# EasyEDA Pro project TSAL大改.eprj

# Schematic Schematic1
Create Date: 2023-09-30; Page Name: P1; Project Name: TSAL大改; Schematic Name: Schematic1; Update Date: 2023-11-05; Company: 嘉立创EDA; Page Size: A4; Version: V1.0
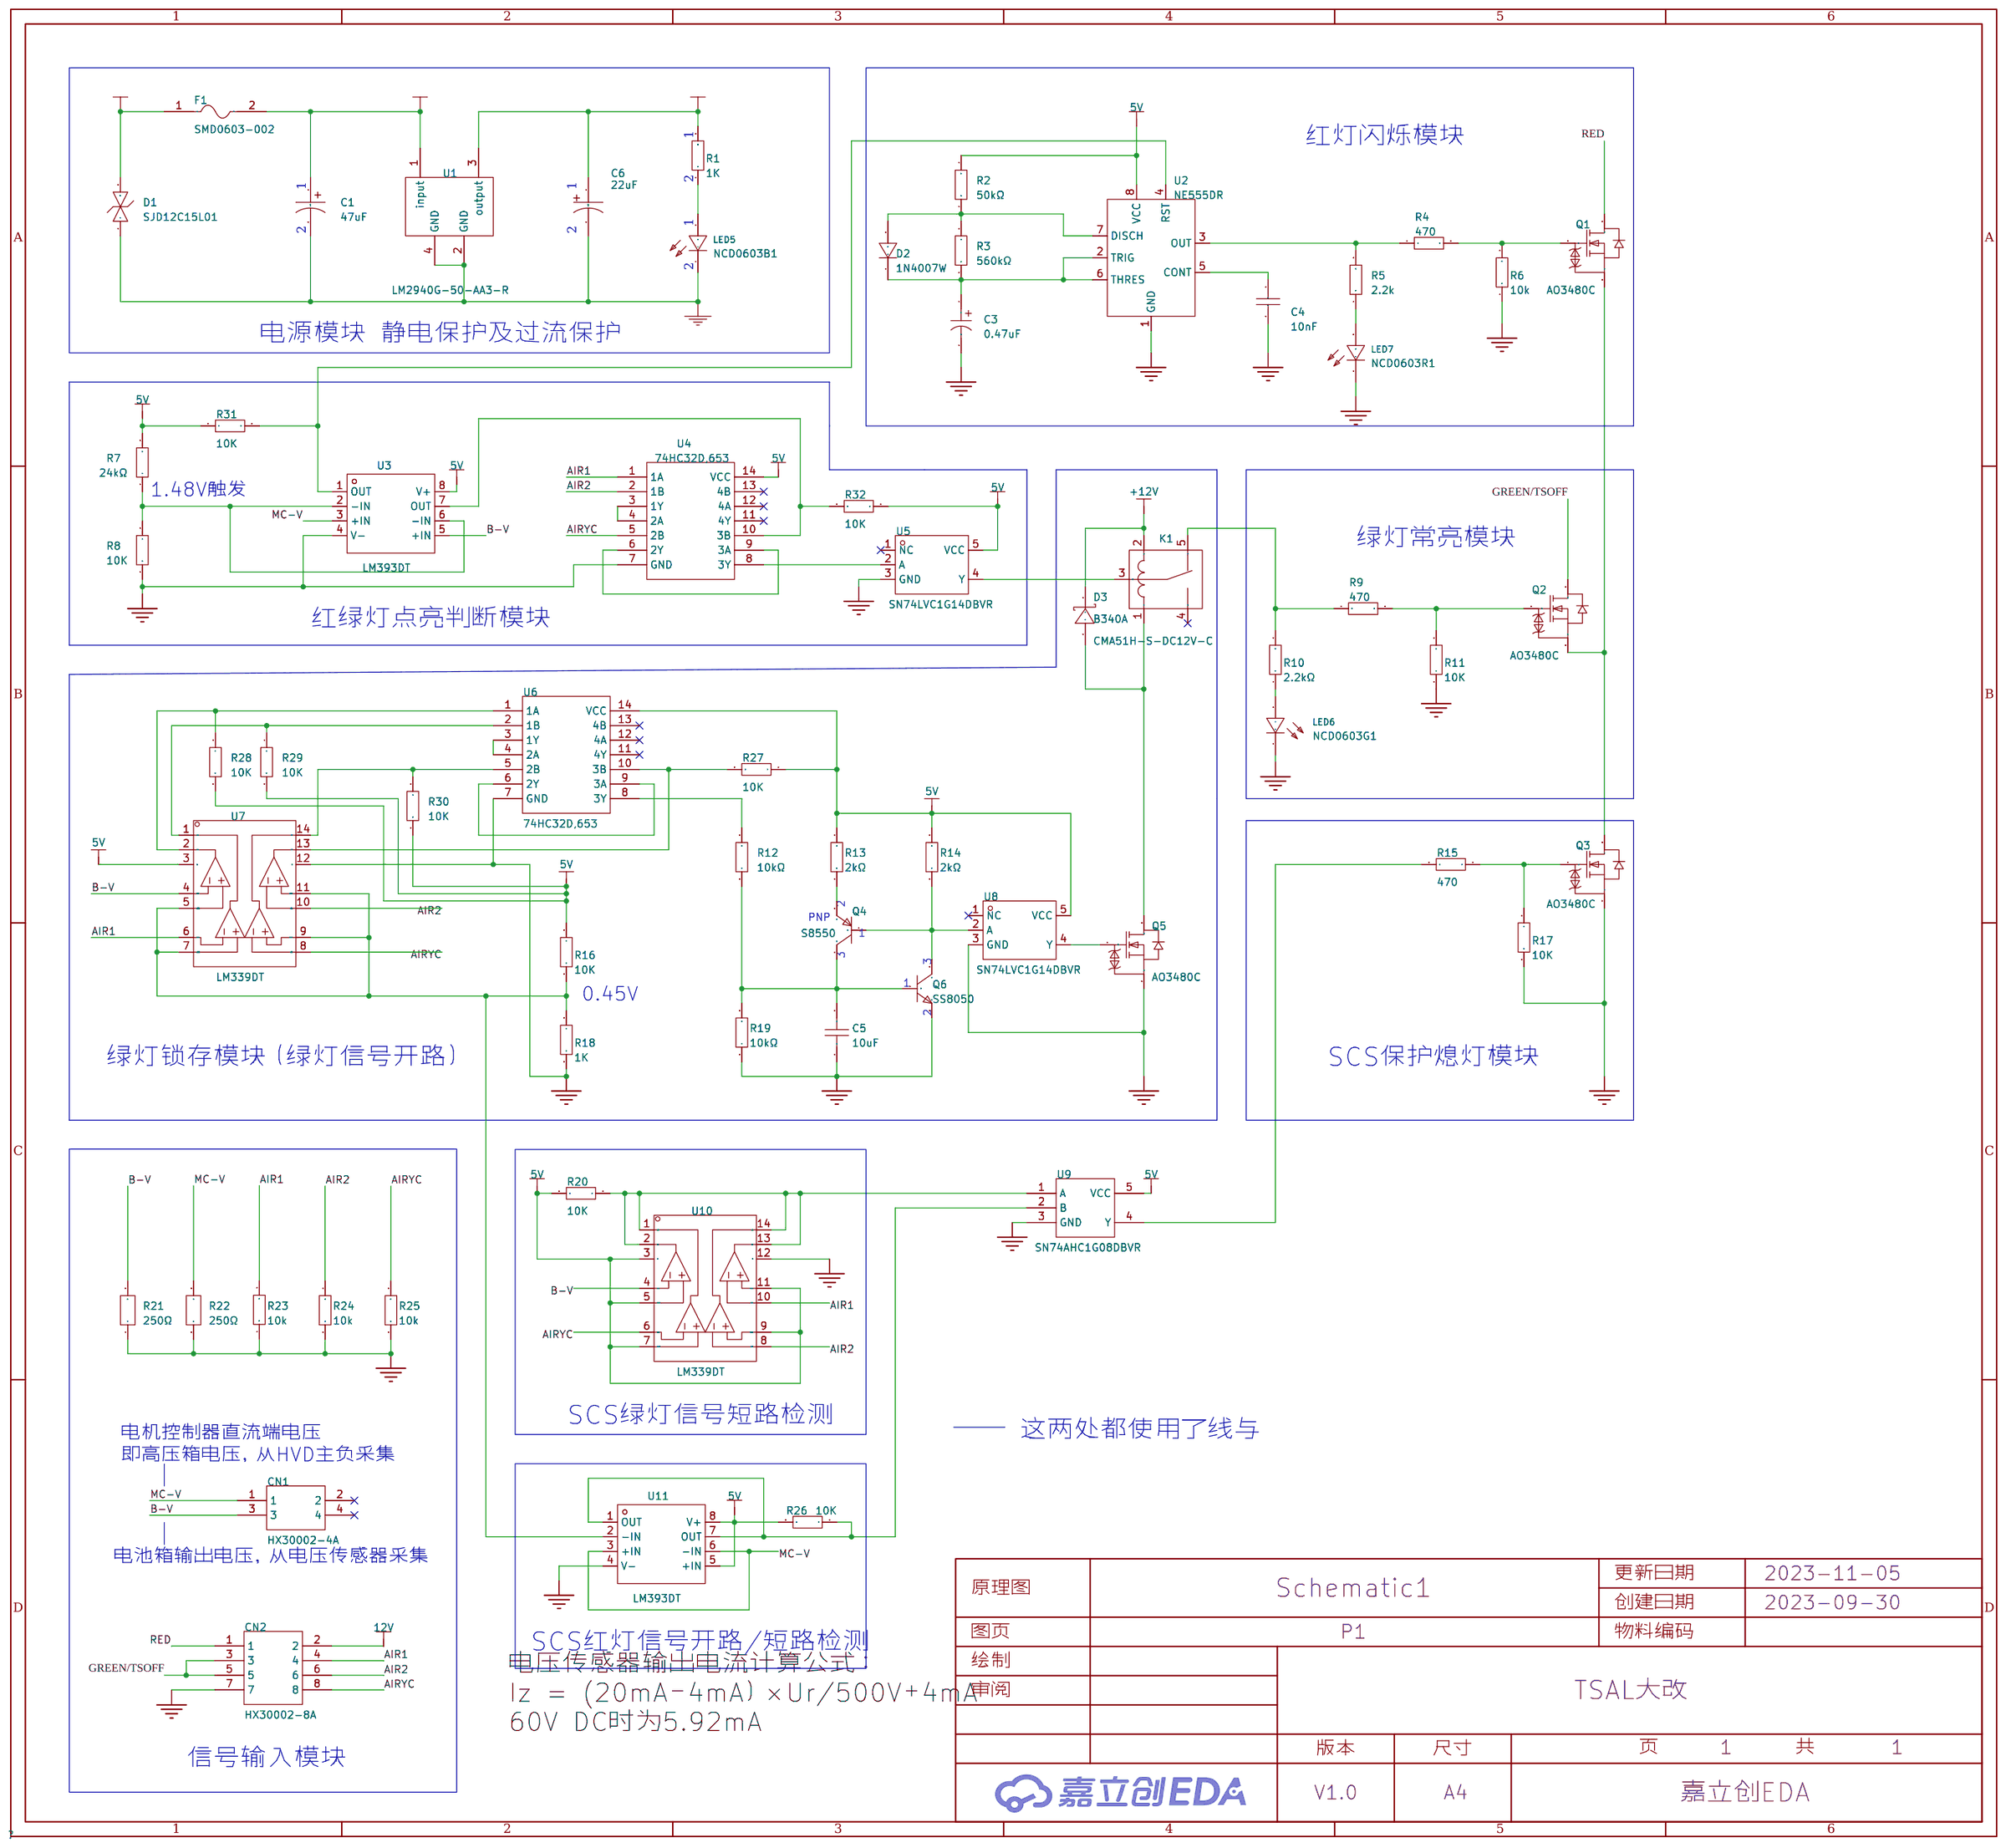
[diagram p0: schematic sheet]

## Parts
C1  47uF  [CAP-SMD_BD8.0-L8.3-W8.3-FD]
C3  0.47uF  [CAP-SMD_L3.2-W1.6-FD-1]
C4  10nF  [C0603]
C5  10uF  [C0603]
C6  22uF  [CAP-SMD_BD6.3-L6.6-W6.6-FD]
CN1  HX30002-4A  [CONN-TH_30002-4A-T1P]
CN2  HX30002-8A  [CONN-TH_30002-8A-T1P]
D1  SJD12C15L01  [SOD-123_L2.7-W1.6-LS3.7-BI]
D2  1N4007W  [SOD-123_L2.8-W1.8-LS3.7-RD]
D3  B340A  [SMA_L4.3-W2.6-LS5.1-RD]
F1  SMD0603-002  [F0603]
K1  CMA51H-S-DC12V-C  [RELAY-TH_CMA51H-S-DCXX-C]
LED5  NCD0603B1  [LED0603-RD]
LED6  NCD0603G1  [LED0603-RD]
LED7  NCD0603R1  [LED0603-RD_RED]
Q1  AO3480C  [SOT-23-3_L2.9-W1.6-P1.90-LS2.8-BR]
Q2  AO3480C  [SOT-23-3_L2.9-W1.6-P1.90-LS2.8-BR]
Q3  AO3480C  [SOT-23-3_L2.9-W1.6-P1.90-LS2.8-BR]
Q4  S8550  [SOT-23-3_L2.9-W1.6-P1.90-LS2.8-BR]
Q5  AO3480C  [SOT-23-3_L2.9-W1.6-P1.90-LS2.8-BR]
Q6  SS8050  [SOT-23-3_L2.9-W1.3-P1.90-LS2.4-BR]
R1  1K  [R0603]
R2  50kΩ  [R0603]
R3  560kΩ  [R0603]
R4  470  [R0603]
R5  2.2k  [R0603]
R6  10k  [R0603]
R7  24kΩ  [R0603]
R8  10K  [R0603]
R9  470  [R0603]
R10  2.2kΩ  [R0603]
R11  10K  [R0603]
R12  10kΩ  [R0603]
R13  2kΩ  [R0603]
R14  2kΩ  [R0603]
R15  470  [R0603]
R16  10K  [R0603]
R17  10K  [R0603]
R18  1K  [R0603]
R19  10kΩ  [R0603]
R20  10K  [R0603]
R21  250Ω  [R0603]
R22  250Ω  [R0603]
R23  10k  [R0603]
R24  10k  [R0603]
R25  10k  [R0603]
R26  10K  [R0603]
R27  10K  [R0603]
R28  10K  [R0603]
R29  10K  [R0603]
R30  10K  [R0603]
R31  10K  [R0603]
R32  10K  [R0603]
U1  LM2940G-50-AA3-R  [SOT-223-4_L6.5-W3.5-P2.30-LS7.0-BR]
U2  NE555DR  [SOIC-8_L4.9-W3.9-P1.27-LS6.0-BL]
U3  LM393DT  [SOIC-8_L5.0-W4.0-P1.27-LS6.0-BL]
U4  74HC32D,653  [SOIC-14_L8.7-W3.9-P1.27-LS6.0-BL]
U5  SN74LVC1G14DBVR  [SOT-23-5_L3.0-W1.7-P0.95-LS2.8-BR]
U6  74HC32D,653  [SOIC-14_L8.7-W3.9-P1.27-LS6.0-BL]
U7  LM339DT  [SOIC-14_L8.7-W3.9-P1.27-LS6.0-BL]
U8  SN74LVC1G14DBVR  [SOT-23-5_L3.0-W1.7-P0.95-LS2.8-BR]
U9  SN74AHC1G08DBVR  [SOT-23-5_L3.0-W1.7-P0.95-LS2.8-BR]
U10  LM339DT  [SOIC-14_L8.7-W3.9-P1.27-LS6.0-BL]
U11  LM393DT  [SOIC-8_L5.0-W4.0-P1.27-LS6.0-BL]

## Library data of the parts
C1 = HBW470M1JTR-0810: 容值:47uF;精度:±20%;额定电压:63V;; LCSC Part Name: 47uF ±20% 63V; Supplier Part: C3031616; Manufacturer: lelon(立隆); Supplier Footprint: SMD,D8xL10mm; JLCPCB Part Class: Extended Part; Datasheet: https://atta.szlcsc.com/upload/public/pdf/source/20220826/AE5C81AD789A3503116A80B6D4FBEF01.pdf; Supplier: LCSC; Tolerance: ±20%; Rated Voltage: 63V; Check: false
C3 = CA45A-A-35V-0.47UF-K: 容值:470nF;精度:±10%;额定电压:35V;; LCSC Part Name: 470nF ±10% 35V; Supplier Part: C2976923; Manufacturer: CEC(振华新云); Supplier Footprint: SMD,1.6x3.2mm; JLCPCB Part Class: 扩展库; Datasheet: https://atta.szlcsc.com/upload/public/pdf/source/20220222/C2C5F368BEBB90E653B4407F98E5644A.pdf; Supplier: LCSC; Tolerance: ±10%; Rated Voltage: 35V; Operating Temperature: -55℃~+125℃; Check: false
C4 = 0603B103K500NT: 容值:10nF;精度:±10%;额定电压:50V;材质(温度系数):X7R;; LCSC Part Name: 10nF ±10% 50V; Supplier Part: C57112; Manufacturer: FH(风华); Supplier Footprint: 0603; JLCPCB Part Class: Basic Part; Datasheet: https://atta.szlcsc.com/upload/public/pdf/source/20170923/C57112_1506149495135988846.pdf; Supplier: LCSC; Tolerance: ±10%; Voltage Rated: 50V; Temperature Coefficient: X7R; Check: false
C5 = CL10A106KP8NNNC: 容值:10uF;精度:±10%;额定电压:10V;材质(温度系数):X5R;; LCSC Part Name: 10uF ±10% 10V; Supplier Part: C19702; Manufacturer: SAMSUNG(三星); Supplier Footprint: 0603; JLCPCB Part Class: Basic Part; Datasheet: https://atta.szlcsc.com/upload/public/pdf/source/20160103/1457707703378.pdf; Supplier: LCSC; Tolerance: ±10%; Voltage Rated: 10V; Temperature Coefficient: X5R; Check: false
C6 = EEHZA1J220XP: 容值:22uF;额定电压:63V;等效串联电阻:80mΩ 100kHz;纹波电流:1.5A 100kHz;工作温度:-55℃~+105℃;类型:-;电容体长度:7.7mm;精度:±20%;电容体直径:6.3mm;脚间距:-;工作寿命:10000hrs 105℃;; LCSC Part Name: 22uF 63V; Supplier Part: C454662; Manufacturer: PANASONIC(松下); Supplier Footprint: SMD,6.3x7.7mm; JLCPCB Part Class: Extended Part; Supplier: LCSC; Rated Voltage: 63V; Equivalent Series Resistance(ESR): 80mΩ 100kHz; Ripple Current: 1.5A 100kHz; Operating Temperature: -55℃~+105℃; L: 7.7mm; Tolerance: ±20%; φD: 6.3mm; Lifetime @ Temp: 10000hrs 105℃
CN1 = HX30002-4A: 参考系列:-;间距:3mm;插针结构:2x2P;排数:2;每排PIN数:2;行距:3mm;安装方式:-;触头材质:黄铜;; LCSC Part Name: 3mm 2x2P; Supplier Part: C185089; Manufacturer: HX(红星); Supplier Footprint: 插件,P=3mm; JLCPCB Part Class: Extended Part; Datasheet: https://atta.szlcsc.com/upload/public/pdf/source/20180316/20CB846A033341ED63BC42C0B6CD4AD3.pdf; Supplier: LCSC; Pitch: 3mm; Pins Structure: 2x2P; Number of Rows: 2; Number of PINs Per Row: 2; Row Spacing: 3mm; Contact Material: 黄铜; Check: false
CN2 = HX30002-8A: 参考系列:-;间距:3mm;插针结构:2x4P;排数:2;每排PIN数:4;行距:3mm;安装方式:-;触头材质:黄铜;; LCSC Part Name: 3mm 2x4P; Supplier Part: C185091; Manufacturer: HX(红星); Supplier Footprint: 插件,P=3mm; JLCPCB Part Class: Extended Part; Datasheet: https://atta.szlcsc.com/upload/public/pdf/source/20180316/D977F4BC65FE6A384A4F595F180FB6F1.pdf; Supplier: LCSC; Pitch: 3mm; Pins Structure: 2x4P; Number of Rows: 2; Number of PINs Per Row: 4; Row Spacing: 3mm; Contact Material: 黄铜; Check: false
D1 = SJD12C15L01: 反向截止电压(Vrwm):15V;击穿电压(VBR):16.7V;峰值脉冲电流(Ipp)@8/20us:8.2A;钳位电压(Vc)@Ipp:24.4V;; Supplier Part: C78437; Manufacturer: Brightking(君耀电子); Supplier Footprint: SOD-123; JLCPCB Part Class: Extended Part; Datasheet: https://atta.szlcsc.com/upload/public/pdf/source/20160709/1468031891025.pdf; Supplier: LCSC; Reverse Stand-Off Voltage (Vrwm): 15V; Breakdown Voltage (VBR): 16.7V; Peak Pulse Current(Ipp)@8/20us: 8.2A; Clamping Voltage@Ipp: 24.4V; Check: false
D2 = 1N4007W_C328592: 二极管配置:独立式;直流反向耐压(Vr):1kV;平均整流电流(Io):1A;正向压降(Vf):1.1V@1A;反向电流(Ir):5uA@1kV;; LCSC Part Name: 1kV 1A 1.1V@1A; Supplier Part: C328592; Manufacturer: BLUE ROCKET(蓝箭); Supplier Footprint: SOD-123FL; JLCPCB Part Class: Extended Part; Datasheet: https://atta.szlcsc.com/upload/public/pdf/source/20181114/C328592_04E3210D024E6B45F90C676B98EEA6C7.pdf; Supplier: LCSC; Diode Configuration: 独立式; Reverse Voltage (Vr): 1kV; Average Rectified Current (Io): 1A; Forward Voltage (Vf@If): 1.1V@1A; Reverse Leakage Current: 5uA@1kV; Check: false
D3 = B340A: 直流反向耐压(Vr):40V;平均整流电流(Io):3A;正向压降(Vf):550mV@3A;; LCSC Part Name: 40V 3A 550mV@3A; Supplier Part: C64982; Manufacturer: MDD; Supplier Footprint: SMA(DO-214AC); JLCPCB Part Class: Extended Part; Datasheet: https://atta.szlcsc.com/upload/public/pdf/source/20230314/FEC98C79C2B2FE8CB6E84FEE53FCCA40.pdf; Supplier: LCSC; Reverse Voltage (Vr): 40V; Average Rectified Current (Io): 3A; Forward Voltage (Vf@If): 550mV@3A; Check: false
F1 = SMD0603-002: 30V,0.02A; LCSC Part Name: 20mA,30V; Supplier Part: C3646886; Manufacturer: 台湾陆海; Supplier Footprint: 0603; JLCPCB Part Class: Extended Part; Datasheet: https://atta.szlcsc.com/upload/public/pdf/source/20230404/20B4F423E9D21310C61C06C0FA62271A.pdf; Supplier: LCSC; Check: false
K1 = CMA51H-S-DC12V-C: 引脚数:5;线圈电压:12V;触点形式:一组转换:1C(单刀双掷-转换);触点容量(电阻负载):15A@14VDC;触点材料:银合金;; LCSC Part Name: 12V继电器 单刀双掷; Supplier Part: C125689; Manufacturer: HKE(汇港); Supplier Footprint: 插件,12.2x15.6mm; JLCPCB Part Class: Extended Part; Datasheet: https://atta.szlcsc.com/upload/public/pdf/source/20171228/C125689_15144410502411213448.pdf; Supplier: LCSC; Pin Number: 5; Coil Voltage: 12V; Coil Rated Power: 600mW; Contact Form: 一组转换:1C(单刀双掷-转换); Contact Rating: 15A@14VDC; Coil Resistance: 240Ω; Maximum Switching Current: 30V@DC; Maximum Switching Voltage: 35A; Operate Time: 10ms; Release Time: 10ms; Coil Type: 非极化-单线圈; Contact Resistance: 50mΩ; Contact Material: 银合金; Operating Temperature: -40℃~+85℃; Check: false
LED5 = NCD0603B1: 发光颜色:蓝灯;; LCSC Part Name: 蓝灯; Supplier Part: C84266; Manufacturer: 国星光电; Supplier Footprint: 0603; JLCPCB Part Class: 扩展库; Datasheet: https://atta.szlcsc.com/upload/public/pdf/source/20200820/C84266_6A3CDBEFA72C6CAD68EDA53474ADAE6C.pdf; Supplier: LCSC; Emitted Color: 蓝灯
LED6 = NCD0603G1: 发光颜色:翠绿;; LCSC Part Name: 翠绿 0603翠绿  正贴; Supplier Part: C84267; Manufacturer: 国星光电; Supplier Footprint: 0603; JLCPCB Part Class: 扩展库; Datasheet: https://atta.szlcsc.com/upload/public/pdf/source/20200820/C84267_04BA7703640BAC111D09F5EFB971FBF3.pdf; Supplier: LCSC; Emitted Color: 翠绿
LED7 = NCD0603R1_C84263: 发光颜色:红灯;; LCSC Part Name: 红灯 0603红灯   正贴; Supplier Part: C84263; Manufacturer: 国星光电; Supplier Footprint: 0603; JLCPCB Part Class: 扩展库; Datasheet: https://atta.szlcsc.com/upload/public/pdf/source/20200820/C84263_DABC6A75E58F576973B407FDBA283D60.pdf; Supplier: LCSC; Emitted Color: 红灯
Q1-Q3 Q5 = AO3480C: 类型:N沟道;漏源电压(Vdss):30V;连续漏极电流(Id):6.2A;功率(Pd):1.3W;导通电阻(RDS(on)@Vgs,Id):16mΩ@10V,6.2A;阈值电压(Vgs(th)@Id):1.8V@250uA;栅极电荷(Qg@Vgs):6nC@10V;输入电容(Ciss@Vds):600pF@15V;反向传输电容(Crss@Vds):60pF@15V;工作温度:-55℃~+150℃@(Tj);; LCSC Part Name: N沟道 30V 6.2A; Supplier Part: C705501; Manufacturer: AOS; Supplier Footprint: SOT-23-3L; JLCPCB Part Class: Extended Part; Datasheet: https://atta.szlcsc.com/upload/public/pdf/source/20200730/C705501_5961B3651997EC68199D4D166737E94A.pdf; Supplier: LCSC; Type: N沟道; Drain Source Voltage (Vdss): 30V; Continuous Drain Current (Id): 6.2A; Power Dissipation (Pd): 1.3W; Drain Source On Resistance (RDS(on)@Vgs,Id): 16mΩ@10V,6.2A; Gate Threshold Voltage (Vgs(th)@Id): 1.8V@250uA; Total Gate Charge (Qg@Vgs): 6nC@10V; Input Capacitance (Ciss@Vds): 600pF@15V; Reverse Transfer Capacitance (Crss@Vds): 60pF@15V; Operating Temperature: -55℃~+150℃@(Tj); Check: false
Q4 = S8550_C105432: 晶体管类型:PNP;集射极击穿电压(Vceo):25V;集电极电流(Ic):500mA;功率(Pd):300mW;直流电流增益(hFE@Ic,Vce):120@50mA,1V;; LCSC Part Name: PNP 25V 500mA L档120-200; Supplier Part: C105432; Manufacturer: CJ(江苏长电/长晶); Supplier Footprint: SOT-23; JLCPCB Part Class: Basic Part; Datasheet: https://atta.szlcsc.com/upload/public/pdf/source/20170413/1492062713649.pdf; Supplier: LCSC; Transistor Type: PNP; Collector-Emitter Breakdown Voltage (Vceo): 25V; Collector Current (Ic): 500mA; Power Dissipation (Pd): 300mW; Collector Cut-Off Current (Icbo): 100nA; Collector-Emitter Saturation Voltage (VCE(sat)@Ic,Ib): 600mV@500mA,50mA; DC Current Gain (hFE@Ic,Vce): 120@50mA,1V; Transition Frequency (fT): 150MHz; Operating Temperature: +150℃@(Tj); Check: false
Q6 = SS8050_C2150: 晶体管类型:NPN;集射极击穿电压(Vceo):25V;集电极电流(Ic):1.5A;功率(Pd):300mW;直流电流增益(hFE@Ic,Vce):200@100mA,1V;; LCSC Part Name: NPN 25V 1.5A Y1 200-350; Supplier Part: C2150; Manufacturer: CJ(江苏长电/长晶); Supplier Footprint: SOT-23; JLCPCB Part Class: Basic Part; Datasheet: https://atta.szlcsc.com/upload/public/pdf/source/20230322/AEE86F4B043774EFF80CAEA14A37D9E9.pdf; Supplier: LCSC; Transistor Type: NPN; Collector-Emitter Breakdown Voltage (Vceo): 25V; Collector Current (Ic): 1.5A; Power Dissipation (Pd): 300mW; Collector Cut-Off Current (Icbo): 100nA; Collector-Emitter Saturation Voltage (VCE(sat)@Ic,Ib): 500mV@800mA,80mA; DC Current Gain (hFE@Ic,Vce): 200@100mA,1V; Transition Frequency (fT): 100MHz; Operating Temperature: +150℃@(Tj); Check: false
R1 R18 = 0603WAF6800T5E: 电阻类型:厚膜电阻;阻值:680Ω;精度:±1%;功率:100mW;; LCSC Part Name: 680Ω ±1% 100mW; Supplier Part: C23228; Manufacturer: UNI-ROYAL(厚声); Supplier Footprint: 0603; JLCPCB Part Class: Basic Part; Datasheet: https://atta.szlcsc.com/upload/public/pdf/source/20200306/C422600_1E6D84923E4A46A82E41ADD87F860B5C.pdf; Supplier: LCSC; Type: 厚膜电阻; Tolerance: ±1%; Power(Watts): 100mW; Temperature Coefficient: ±100ppm/℃; Overload Voltage (Max): 75V; Operating Temperature Range: -55℃~+155℃; Check: false
R2 = AR03BTC5002A: 阻值:50kΩ;精度:±0.1%;功率:62.5mW;; LCSC Part Name: 50kΩ ±0.1% 62.5mW; Supplier Part: C304067; Manufacturer: Viking(光颉); Supplier Footprint: 0603; JLCPCB Part Class: Extended Part; Datasheet: https://atta.szlcsc.com/upload/public/pdf/source/20180929/C304067_C6C1AA1A73175DF88A934A2863C540D5.pdf; Supplier: LCSC; Tolerance: ±0.1%; Power(Watts): 62.5mW; Temperature Coefficient: ±25ppm/℃
R3 = 0603WAF5603T5E: 电阻类型:厚膜电阻;阻值:560kΩ;精度:±1%;功率:100mW;; LCSC Part Name: 560kΩ ±1% 100mW; Supplier Part: C23203; Manufacturer: UNI-ROYAL(厚声); Supplier Footprint: 0603; JLCPCB Part Class: 基础库; Datasheet: https://atta.szlcsc.com/upload/public/pdf/source/20200306/C422600_1E6D84923E4A46A82E41ADD87F860B5C.pdf; Supplier: LCSC; Type: 厚膜电阻; Tolerance: ±1%; Power(Watts): 100mW; Temperature Coefficient: ±100ppm/℃; Overload Voltage (Max): 75V; Operating Temperature Range: -55℃~+155℃
R4 R9 R15 = 0603WAF4700T5E: 电阻类型:厚膜电阻;阻值:470Ω;精度:±1%;功率:100mW;; LCSC Part Name: 470Ω ±1% 100mW; Supplier Part: C23179; Manufacturer: UNI-ROYAL(厚声); Supplier Footprint: 0603; JLCPCB Part Class: Basic Part; Datasheet: https://atta.szlcsc.com/upload/public/pdf/source/20200306/C422600_1E6D84923E4A46A82E41ADD87F860B5C.pdf; Supplier: LCSC; Type: 厚膜电阻; Tolerance: ±1%; Power(Watts): 100mW; Temperature Coefficient: ±100ppm/℃; Overload Voltage (Max): 75V; Operating Temperature Range: -55℃~+155℃; Check: false
R5 R10 = 0603WAF2201T5E: 电阻类型:厚膜电阻;阻值:2.2kΩ;精度:±1%;功率:100mW;; LCSC Part Name: 2.2kΩ ±1% 100mW; Supplier Part: C4190; Manufacturer: UNI-ROYAL(厚声); Supplier Footprint: 0603; JLCPCB Part Class: Basic Part; Datasheet: https://atta.szlcsc.com/upload/public/pdf/source/20200306/C422600_1E6D84923E4A46A82E41ADD87F860B5C.pdf; Supplier: LCSC; Type: 厚膜电阻; Tolerance: ±1%; Power(Watts): 100mW; Temperature Coefficient: ±100ppm/℃; Overload Voltage (Max): 75V; Operating Temperature Range: -55℃~+155℃; Check: false
R6 R12 R19 R23-R25 = 0603WAF1002T5E: 电阻类型:厚膜电阻;阻值:10kΩ;精度:±1%;功率:100mW;; LCSC Part Name: 厚膜电阻 10kΩ ±1% 100mW; Supplier Part: C25804; Manufacturer: UNI-ROYAL(厚声); Supplier Footprint: 0603; JLCPCB Part Class: Basic Part; Datasheet: https://atta.szlcsc.com/upload/public/pdf/source/20200306/C422600_1E6D84923E4A46A82E41ADD87F860B5C.pdf; Supplier: LCSC; Type: 厚膜电阻; Tolerance: ±1%; Power(Watts): 100mW; Temperature Coefficient: ±100ppm/℃; Overload Voltage (Max): 75V; Operating Temperature Range: -55℃~+155℃; Check: false
R7 = 0603WAF2402T5E: 电阻类型:厚膜电阻;阻值:24kΩ;精度:±1%;功率:100mW;; LCSC Part Name: 24kΩ ±1% 100mW; Supplier Part: C23352; Manufacturer: UNI-ROYAL(厚声); Supplier Footprint: 0603; JLCPCB Part Class: 基础库; Datasheet: https://atta.szlcsc.com/upload/public/pdf/source/20200306/C422600_1E6D84923E4A46A82E41ADD87F860B5C.pdf; Supplier: LCSC; Type: 厚膜电阻; Tolerance: ±1%; Power(Watts): 100mW; Temperature Coefficient: ±100ppm/℃; Overload Voltage (Max): 75V; Operating Temperature Range: -55℃~+155℃
R8 R11 R16 R17 R20 R26-R32 = Res_0603: Supplier Footprint: 0603; Check: false
R13 R14 = 0603WAF2001T5E: 电阻类型:厚膜电阻;阻值:2kΩ;精度:±1%;功率:100mW;; LCSC Part Name: 2kΩ ±1% 100mW; Supplier Part: C22975; Manufacturer: UNI-ROYAL(厚声); Supplier Footprint: 0603; JLCPCB Part Class: Basic Part; Datasheet: https://atta.szlcsc.com/upload/public/pdf/source/20200306/C422600_1E6D84923E4A46A82E41ADD87F860B5C.pdf; Supplier: LCSC; Type: 厚膜电阻; Tolerance: ±1%; Power(Watts): 100mW; Temperature Coefficient: ±100ppm/℃; Overload Voltage (Max): 75V; Operating Temperature Range: -55℃~+155℃; Check: false
R21 R22 = ARG03DTC2500: 电阻类型:薄膜电阻;阻值:250Ω;精度:±0.5%;功率:100mW;; LCSC Part Name: 250Ω ±0.5% 100mW; Supplier Part: C2828652; Manufacturer: Viking(光颉); Supplier Footprint: 0603; JLCPCB Part Class: Extended Part; Datasheet: https://atta.szlcsc.com/upload/public/pdf/source/20211009/C2828652_FB7EDA2C6E724E0EB8482109143029B0.pdf; Supplier: LCSC; Type: 薄膜电阻; Tolerance: ±0.5%; Power(Watts): 100mW; Temperature Coefficient: ±25ppm/℃; Overload Voltage (Max): 75V; Operating Temperature Range: -55℃~+155℃
U1 = LM2940G-50-AA3-R: 输出类型:固定;输出极性:正;输出通道数:1;最大输入电压:26V;输出电压:5V;压差:800mV@(1A);输出电流:1A;电源纹波抑制比(PSRR):72dB@(120Hz);; LCSC Part Name: 正 Vin=26V Vout=5V 1A 72dB@(120Hz); Supplier Part: C71094; Manufacturer: UTC(友顺); Supplier Footprint: SOT-223-4; JLCPCB Part Class: Extended Part; Datasheet: https://atta.szlcsc.com/upload/public/pdf/source/20160416/1460799393051.pdf; Supplier: LCSC; Output Type: 固定; Output Polarity: 正; Number of Outputs: 1; Maximum Input Voltage: 26V; Output Voltage: 5V; Dropout Voltage: 800mV@(1A); Output Current: 1A; Power Supply Rejection Ratio (PSRR): 72dB@(120Hz); Check: false
U2 = NE555DR_C7593: 类型:555 型，计时器/振荡器(单路);计数:-;工作电压:4.5V~16V;工作电流:10mA;工作温度:0℃~+70℃;; Supplier Part: C7593; Manufacturer: TI(德州仪器); Supplier Footprint: SOIC-8-150mil; JLCPCB Part Class: Basic Part; Datasheet: https://atta.szlcsc.com/upload/public/pdf/source/20140704/1457707116116.pdf; Supplier: LCSC; Type: 555 型，计时器/振荡器(单路); Supply Voltage: 4.5V~16V; Supply Current: 10mA; Operating Temperature: 0℃~+70℃; Check: false
U3 U11 = LM393DT: 比较器组数:2;电源电压:2V~36V,±1V~18V;各通道供电电流:2.5mA;输出类型:CMOS, MOS, Open-Collector, TTL;传播延迟:-;; Supplier Part: C32901; Manufacturer: ST(意法半导体); Supplier Footprint: SOIC-8; JLCPCB Part Class: Extended Part; Datasheet: https://atta.szlcsc.com/upload/public/pdf/source/20140704/1457707098538.pdf; Supplier: LCSC; Number of Elements: 2; Supply Voltage（Single）: 2V~36V,±1V~18V; Iq per channel (Typ): 2.5mA; Output Type: CMOS, MOS, Open-Collector, TTL; Operating Temperature: 0°C ~ 70°C; Check: false
U4 U6 = 74HC32D,653: 逻辑电路的归属系列:74HC;逻辑类型:或门;通道数:4;每通道输入数:2;电源电压:2V~6V;静态电流(最大值):2uA;; LCSC Part Name: 或门; Supplier Part: C5632; Manufacturer: Nexperia(安世); Supplier Footprint: SOIC-14-150mil; JLCPCB Part Class: Extended Part; Datasheet: https://atta.szlcsc.com/upload/public/pdf/source/20120402/1457706456034.pdf; Supplier: LCSC; Series: 74HC; Logic Type: 或门; number of channels: 4; Number of inputs per channel: 2; Supply Voltage(Single): 2V~6V; Quiescent Current (Max): 2uA; Max Propagation Delay @ V, Max CL: 15ns@6V,50pF; Low Level Output Current: 5.2mA; Hight Level Output Current: 5.2mA; Logical Level - High: 1.5V~4.2V; Logical Level - low: 0.5V~1.8V; Operating Temperature: -40℃~+125℃; Check: false
U5 = SN74LVC1G14DBVR_C434069: 逻辑电路的归属系列:-;逻辑类型:-;电路/元件数:-;输入数/每元件位数:-;电源电压:-;静态电流（最大值）:-;; LCSC Part Name: 门极和反相器; Supplier Part: C434069; Manufacturer: UMW(广东友台半导体); Supplier Footprint: SOT-23-5; JLCPCB Part Class: Extended Part; Datasheet: https://atta.szlcsc.com/upload/public/pdf/source/20190930/C434069_601D37537AF749E7095B833416EB8C97.pdf; Supplier: LCSC
U7 U10 = LM339DT: 比较器组数:4;电源电压:2V ~ 32V, ±1V ~ 16V;各通道供电电流:2.5mA;输出类型:CMOS, DTL, ECL, MOS, Open-Collector, TTL;传播延迟:-;; Supplier Part: C71036; Manufacturer: ST(意法半导体); Supplier Footprint: SO14; JLCPCB Part Class: Extended Part; Datasheet: https://atta.szlcsc.com/upload/public/pdf/source/20160408/1460100649765.pdf; Supplier: LCSC; Number of Elements: 4; Supply Voltage（Single）: 2V ~ 32V, ±1V ~ 16V; Iq per channel (Typ): 2.5mA; Output Type: CMOS, DTL, ECL, MOS, Open-Collector, TTL; Operating Temperature: 0°C ~ 70°C; Check: false
U8 = SN74LVC1G14DBVR_C434069: 逻辑电路的归属系列:-;逻辑类型:-;电路/元件数:-;输入数/每元件位数:-;电源电压:-;静态电流（最大值）:-;; LCSC Part Name: 门极和反相器; Supplier Part: C434069; Manufacturer: UMW(广东友台半导体); Supplier Footprint: SOT-23-5; JLCPCB Part Class: Extended Part; Datasheet: https://atta.szlcsc.com/upload/public/pdf/source/20190930/C434069_601D37537AF749E7095B833416EB8C97.pdf; Supplier: LCSC; Check: false
U9 = SN74AHC1G08DBVR: 逻辑电路的归属系列:74AHC;逻辑类型:与门;通道数:1;每通道输入数:2;电源电压:2V~5.5V;静态电流(最大值):1uA;; LCSC Part Name: 与门; Supplier Part: C7467; Manufacturer: TI(德州仪器); Supplier Footprint: SOT-23-5; JLCPCB Part Class: 扩展库; Datasheet: https://atta.szlcsc.com/upload/public/pdf/source/20140711/1457707153876.pdf; Supplier: LCSC; Series: 74AHC; Logic Type: 与门; number of channels: 1; Number of inputs per channel: 2; Supply Voltage(Single): 2V~5.5V; Quiescent Current (Max): 1uA; Max Propagation Delay @ V, Max CL: 7.9ns@5V,50pF; Low Level Output Current: 8mA; Hight Level Output Current: 8mA; Logical Level - High: 1.5V~3.85V; Logical Level - low: 0.5V~1.65V; Operating Temperature: -55℃~+125℃

## Nets
5V: C6.1 R1.2 R2.2 R7.2 R13.2 R14.2 R16.2 R20.2 R26.2 R27.1 R28.2 R29.2 R30.2 R31.1 R32.2 U1.3(output) U2.8(VCC) U3.8(V+) U4.14(VCC) U5.5(VCC) U6.14(VCC) U7.3(VDD) U8.5(VCC) U9.5(VCC) U10.3(VDD) U10.5(Non-inverting input1) U10.7(Non-inverting input2) U10.9(Non-inverting input3) U10.11(Non-inverting input4) U11.5(+IN) U11.8(V+)
12V: CN2.2 D1.2 F1.1
+12V: C1.1 D3.1(K) F1.2 K1.2 U1.1(input)
GND: C1.2 C3.2 C4.2 C5.2 C6.2 CN2.7 D1.1 LED5.1(-) LED6.1(K) LED7.1(K) Q3.2(S) Q5.2(S) Q6.2(E) R6.1 R8.1 R11.1 R17.1 R18.1 R19.1 R21.1 R22.1 R23.1 R24.1 R25.1 U1.2(GND) U1.4(GND) U2.1(GND) U3.4(V-) U4.7(GND) U5.3(GND) U6.7(GND) U7.12(GND) U8.3(GND) U9.3(GND) U10.12(GND) U11.4(V-)
AIR1: CN2.4 R23.2 U4.1(1A) U7.6(Inverting input2) U10.10(Inverting input4)
AIR2: CN2.6 R24.2 U4.2(1B) U7.10(Inverting input4) U10.8(Inverting input3)
AIRYC: CN2.8 R25.2 U4.5(2B) U7.8(Inverting input3) U10.6(Inverting input2)
B-V: CN1.3 R21.2 U3.5(+IN) U7.4(Inverting input1) U10.4(Inverting input1)
GREEN/TSOFF: CN2.3 CN2.5 Q2.3(D)
MC-V: CN1.1 R22.2 U3.3(+IN) U11.3(+IN) U11.6(-IN)
RED: CN2.1 Q1.3(D)
$1N2847: Q4.2(E) R13.1
$1N2848: C5.1 Q4.3(C) Q6.1(B) R12.1 R19.2
$1N2855: Q4.1(B) Q6.3(C) R14.1 U8.2(A)
$1N2859: Q5.1(G) U8.4(Y)
$1N2861: D3.2(A) K1.1 Q5.3(D)
$1N2891: U6.3(1Y) U6.4(2A)
$1N2893: R30.1 U6.5(2B) U7.14(OUTPUT3)
$1N2896: U6.6(2Y) U6.9(3A)
$1N2911: R12.2 U6.8(3Y)
$1N2915: Q2.1(G) R9.1 R11.2
$1N2916: LED6.2(A) R10.1
$1N2920: K1.5 R9.2 R10.2
$1N2921: D2.2 R2.1 R3.2 U2.7(DISCH)
$1N2924: C4.1 U2.5(CONT)
$1N2925: R4.1 R5.2 U2.3(OUT)
$1N2926: LED7.2(A) R5.1
$1N2929: Q1.1(G) R4.2 R6.2
$1N2932: C3.1 D2.1 R3.1 U2.2(TRIG) U2.6(THRES)
$1N2938: Q1.2(S) Q2.2(S) Q3.3(D)
$1N2947: Q3.1(G) R15.1 R17.2
$1N2957: U4.3(1Y) U4.4(2A)
$1N2959: U4.6(2Y) U4.9(3A)
$1N2978: U4.8(3Y) U5.2(A)
$1N2980: K1.3 U5.4(Y)
$1N2999: R7.1 R8.2 U3.2(-IN) U3.6(-IN)
$1N3023: LED5.2(+) R1.1
$1N3072: R26.1 U9.2(B) U11.1(OUT) U11.7(OUT)
$1N3096: R15.2 U9.4(Y)
$1N3104: R16.1 R18.2 U7.5(Non-inverting input1) U7.7(Non-inverting input2) U7.9(Non-inverting input3) U7.11(Non-inverting input4) U11.2(-IN)
$1N11259: R20.1 U9.1(A) U10.1(OUTPUT2) U10.2(OUTPUT1) U10.13(OUTPUT4) U10.14(OUTPUT3)
$1N21896: R27.2 U6.10(3B) U7.13(OUTPUT4)
$1N21955: R29.1 U6.2(1B) U7.1(OUTPUT2)
$1N22037: R28.1 U6.1(1A) U7.2(OUTPUT1)
$1N22090: R31.2 U2.4(RST) U3.1(OUT)
$1N22133: R32.1 U3.7(OUT) U4.10(3B)

Not connected (* = marked no-connect by the designer): CN1 2* 4*; K1 4*; U4 11(4Y)* 12(4A)* 13(4B)*; U5 1(NC)*; U6 11(4Y)* 12(4A)* 13(4B)*; U8 1(NC)*

## Notes on the sheet
- 1
- 红灯闪烁模块
- 2
- 1
- 1
- 2
- 2
- 1
- 2
- 电源模块 静电保护及过流保护
- 1.48V触发
- 绿灯常亮模块
- 红绿灯点亮判断模块
- 2
- PNP
- 1
- 3
- 3
- 1
- 0.45V
- 2
- 绿灯锁存模块（绿灯信号开路）
- SCS保护熄灯模块
- SCS绿灯信号短路检测
- 电机控制器直流端电压
- 这两处都使用了线与
- 即高压箱电压，从HVD主负采集
- 电池箱输出电压，从电压传感器采集
- SCS红灯信号开路/短路检测
- 电压传感器输出电流计算公式：
  Iz = (20mA－4mA）×Ur/500V＋4mA
  60V DC时为5.92mA
- 信号输入模块

# Board PCB1
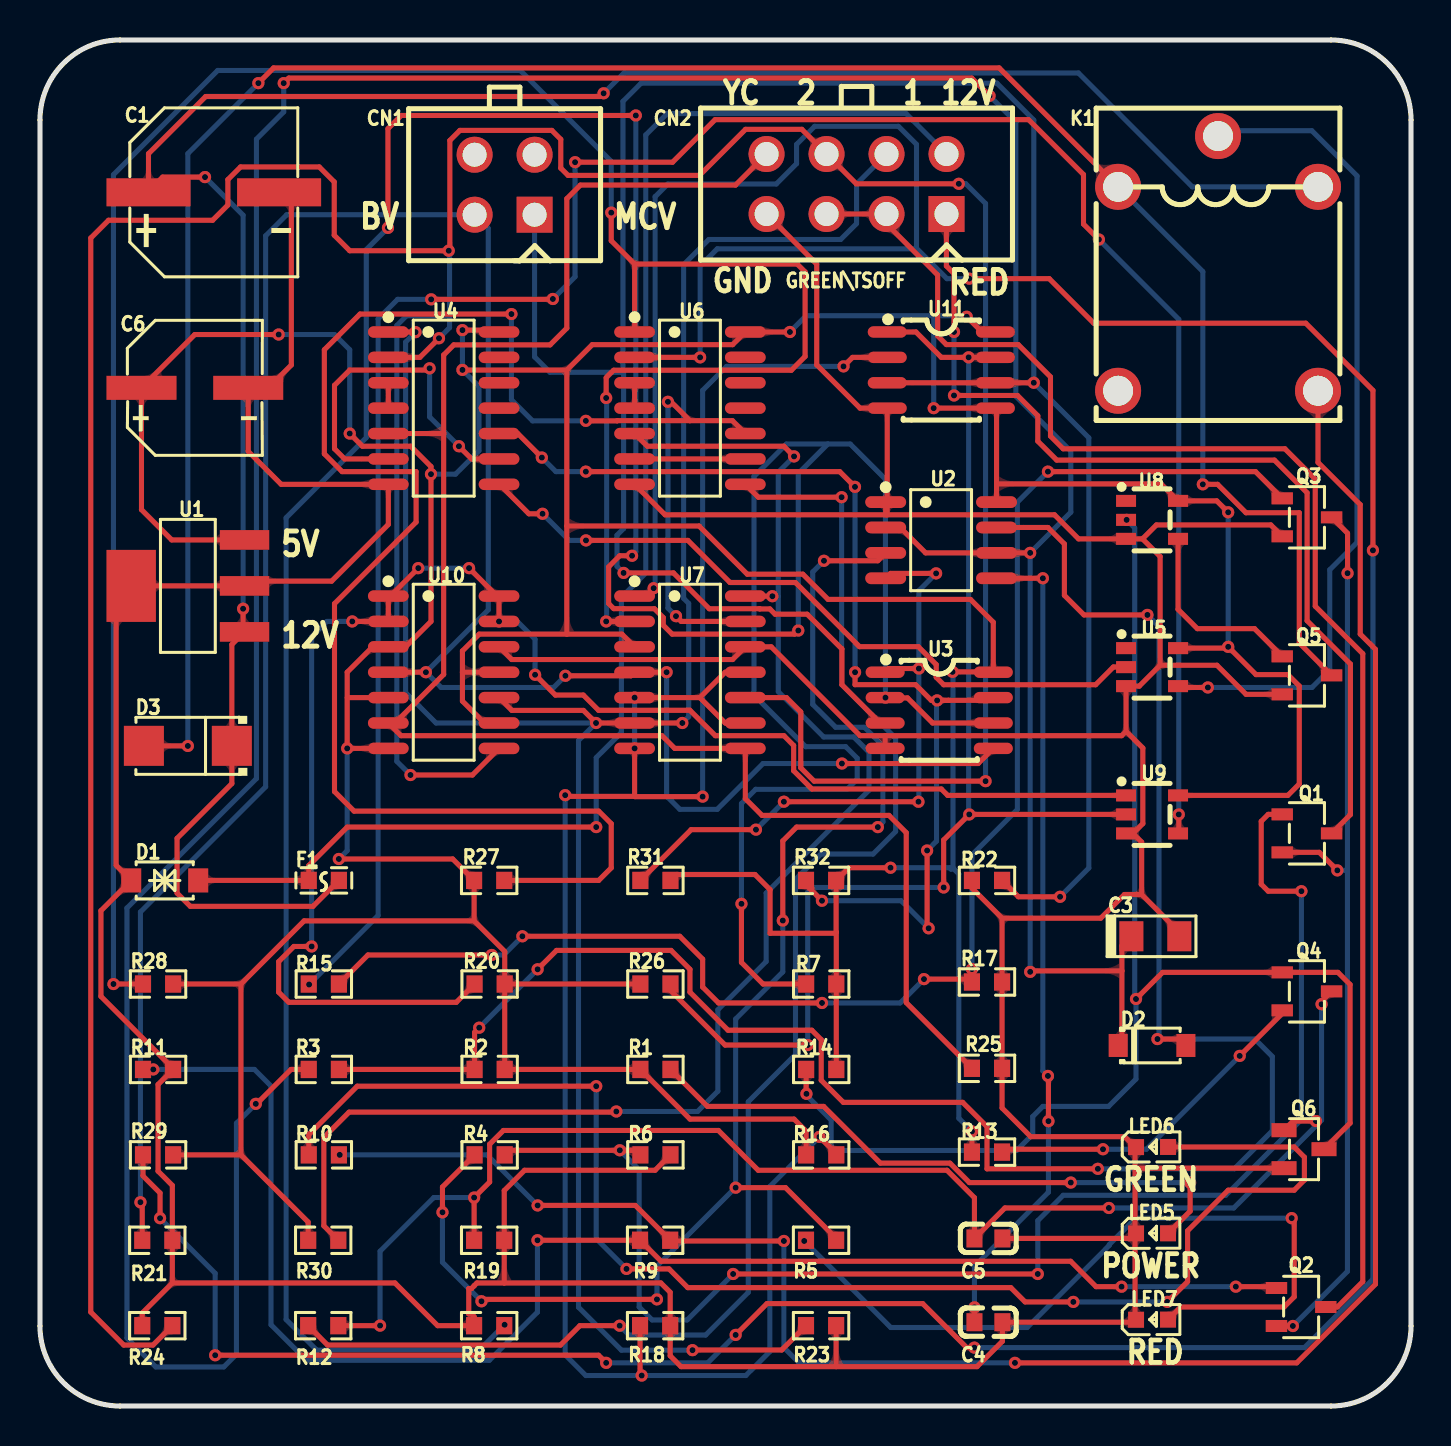
[diagram p1: board, top side]
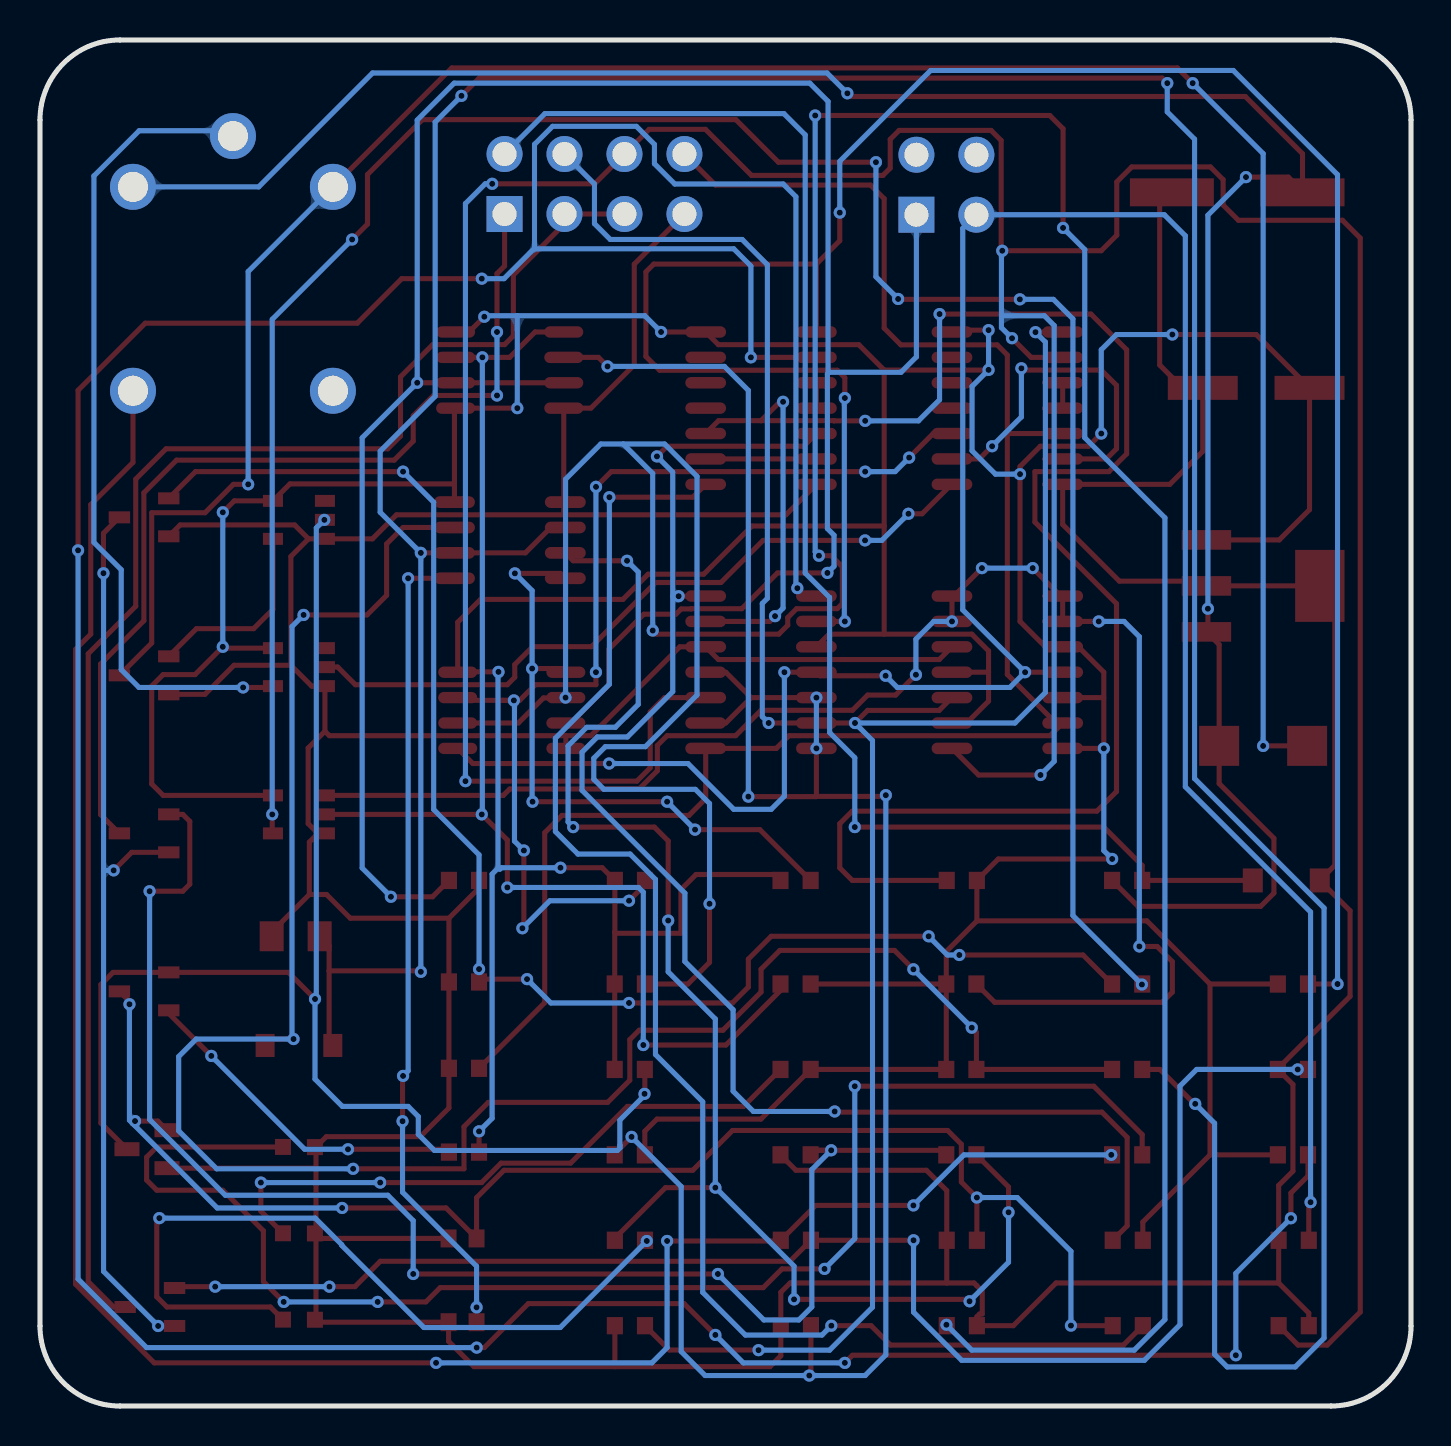
[diagram p2: board, bottom side, seen from below]

Outline 68.58 x 68.33 mm; copper layers: Top Layer, Bottom Layer. Coordinates in mm from the lower left corner of the outline.
Outline path: 0,64.33 0,4 arc(1.17,1.17) 4,0 64.58,0 arc(67.41,1.17) 68.58,4 68.58,64.33 arc(67.41,67.15) 64.58,68.33 4,68.33 arc(1.17,67.15) 0,64.33
Stack: Top Layer 0.035mm / Dielectric1 1.51mm FR4 er 4.5 / Bottom Layer 0.035mm

## Design rules (mm)
template: JLCPCB Capability(Two Layers Board)
spacing copperThickness1oz (default): track to track 0.102, other pairs 0.152 to 0.3
spacing copperThickness2oz: track to track 0.203, other pairs 0.152 to 0.3
track width copperThickness1oz (default): min 0.127, default 0.254, max 2.54
track width copperThickness2oz: min 0.203, default 0.254, max 2.54
differential pair differentialPair (default): width min 0.127, default 0.254, max 2.54; gap min 0.152, default 0.152
via viaSize (default): diameter min 0.5, default 0.61, max 10; hole min 0.3, default 0.305, max 6.3

## Placement (name value [footprint] x y rotation side)
C1  47uF  [CAP-SMD_BD8.0-L8.3-W8.3-FD]  8.69 60.71 0 top
C3  0.47uF  [CAP-SMD_L3.2-W1.6-FD-1]  55.79 23.49 0 top
C4  10nF  [C0603]  47.44 4.19 0 top
C5  10uF  [C0603]  47.44 8.38 0 top
C6  22uF  [CAP-SMD_BD6.3-L6.6-W6.6-FD]  7.75 50.93 0 top
CN1  HX30002-4A  [CONN-TH_30002-4A-T1P]  23.24 61.09 180 top
CN2  HX30002-8A  [CONN-TH_30002-8A-T1P]  40.84 61.12 180 top
D1  SJD12C15L01  [SOD-123_L2.7-W1.6-LS3.7-BI]  6.24 26.29 0 top
D2  1N4007W  [SOD-123_L2.8-W1.8-LS3.7-RD]  55.63 18.03 0 top
D3  B340A  [SMA_L4.3-W2.6-LS5.1-RD]  7.4 33.02 180 top
F1  SMD0603-002  [F0603]  14.2 26.29 0 top
K1  CMA51H-S-DC12V-C  [RELAY-TH_CMA51H-S-DCXX-C]  58.93 57.15 270 top
LED5  NCD0603B1  [LED0603-RD]  55.63 8.64 0 top
LED6  NCD0603G1  [LED0603-RD]  55.63 12.95 0 top
LED7  NCD0603R1  [LED0603-RD_RED]  55.63 4.32 0 top
Q1  AO3480C  [SOT-23-3_L2.9-W1.6-P1.90-LS2.8-BR]  63.37 28.64 180 top
Q2  AO3480C  [SOT-23-3_L2.9-W1.6-P1.90-LS2.8-BR]  63.08 4.95 180 top
Q3  AO3480C  [SOT-23-3_L2.9-W1.6-P1.90-LS2.8-BR]  63.37 44.45 180 top
Q4  S8550  [SOT-23-3_L2.9-W1.6-P1.90-LS2.8-BR]  63.37 20.74 180 top
Q5  AO3480C  [SOT-23-3_L2.9-W1.6-P1.90-LS2.8-BR]  63.37 36.55 180 top
Q6  SS8050  [SOT-23-3_L2.9-W1.3-P1.90-LS2.4-BR]  63.23 12.85 180 top
R1  1K  [R0603]  30.78 16.83 180 top
R2  50kΩ  [R0603]  22.49 16.83 0 top
R3  560kΩ  [R0603]  14.2 16.83 0 top
R4  470  [R0603]  22.49 12.56 0 top
R5  2.2k  [R0603]  39.07 8.29 0 top
R6  10k  [R0603]  30.78 12.56 180 top
R7  24kΩ  [R0603]  39.08 21.11 0 top
R8  10K  [R0603]  22.47 4.02 0 top
R9  470  [R0603]  30.77 8.29 0 top
R10  2.2kΩ  [R0603]  14.2 12.56 0 top
R11  10K  [R0603]  5.91 16.83 180 top
R12  10kΩ  [R0603]  14.17 4.02 180 top
R13  2kΩ  [R0603]  47.37 12.7 180 top
R14  2kΩ  [R0603]  39.08 16.83 0 top
R15  470  [R0603]  14.2 21.11 180 top
R16  10K  [R0603]  39.08 12.56 180 top
R17  10K  [R0603]  47.37 21.21 180 top
R18  1K  [R0603]  30.77 4.02 180 top
R19  10kΩ  [R0603]  22.47 8.29 180 top
R20  10K  [R0603]  22.49 21.11 0 top
R21  250Ω  [R0603]  5.87 8.29 180 top
R22  250Ω  [R0603]  47.37 26.29 0 top
R23  10k  [R0603]  39.07 4.02 180 top
R24  10k  [R0603]  5.87 4.02 0 top
R25  10k  [R0603]  47.37 16.89 180 top
R26  10K  [R0603]  30.78 21.11 180 top
R27  10K  [R0603]  22.47 26.29 0 top
R28  10K  [R0603]  5.91 21.11 0 top
R29  10K  [R0603]  5.91 12.56 0 top
R30  10K  [R0603]  14.17 8.29 180 top
R31  10K  [R0603]  30.78 26.29 180 top
R32  10K  [R0603]  39.07 26.29 0 top
U1  LM2940G-50-AA3-R  [SOT-223-4_L6.5-W3.5-P2.30-LS7.0-BR]  7.4 41.02 0 top
U2  NE555DR  [SOIC-8_L4.9-W3.9-P1.27-LS6.0-BL]  45.07 43.31 270 top
U3  LM393DT  [SOIC-8_L5.0-W4.0-P1.27-LS6.0-BL]  44.98 34.8 270 top
U4  74HC32D,653  [SOIC-14_L8.7-W3.9-P1.27-LS6.0-BL]  20.19 49.91 270 top
U5  SN74LVC1G14DBVR  [SOT-23-5_L3.0-W1.7-P0.95-LS2.8-BR]  55.63 36.96 180 top
U6  74HC32D,653  [SOIC-14_L8.7-W3.9-P1.27-LS6.0-BL]  32.51 49.91 270 top
U7  LM339DT  [SOIC-14_L8.7-W3.9-P1.27-LS6.0-BL]  32.51 36.7 270 top
U8  SN74LVC1G14DBVR  [SOT-23-5_L3.0-W1.7-P0.95-LS2.8-BR]  55.63 44.32 180 top
U9  SN74AHC1G08DBVR  [SOT-23-5_L3.0-W1.7-P0.95-LS2.8-BR]  55.63 29.59 180 top
U10  LM339DT  [SOIC-14_L8.7-W3.9-P1.27-LS6.0-BL]  20.19 36.7 270 top
U11  LM393DT  [SOIC-8_L5.0-W4.0-P1.27-LS6.0-BL]  45.09 51.82 270 top

## Footprints (pads in the part's own frame, mm; a bottom-side part is the same pattern mirrored in y, then rotated)
C0603
  rect 0.8x0.9 smd: 1(-0.7,0) 2(0.7,0)
CAP-SMD_BD6.3-L6.6-W6.6-FD
  rect 3.5x1.2 smd: 1(-2.67,0) 2(2.67,0)
CAP-SMD_BD8.0-L8.3-W8.3-FD
  rect 4.2x1.4 smd: 1(-3.267,0) 2(3.267,0)
CAP-SMD_L3.2-W1.6-FD-1
  rect 1.2x1.5 smd: 1(-1.2,0) 2(1.2,0)
CONN-TH_30002-4A-T1P
  rect 1.8x1.8 hole 1.2: 1(-1.5,1.5)
  round 1.8 hole 1.2: 2(-1.5,-1.5) 3(1.5,1.5) 4(1.5,-1.5)
CONN-TH_30002-8A-T1P
  rect 1.8x1.8 hole 1.2: 1(-4.5,1.5)
  round 1.8 hole 1.2: 2(-4.5,-1.5) 3(-1.5,1.5) 4(-1.5,-1.5) 5(1.5,1.5) 6(1.5,-1.5) 7(4.5,1.5) 8(4.5,-1.5)
F0603
  rect 0.806x0.864 smd: 1(-0.753,0) 2(0.753,0)
LED0603-RD
  rect 0.8x0.8 smd: 1(-0.799,-0.004) 2(0.799,0.004)
LED0603-RD_RED
  rect 0.8x0.8 smd: 1(-0.799,-0.004) 2(0.799,0.004)
R0603
  rect 0.806x0.864 smd: 1(-0.753,0) 2(0.753,0)
RELAY-TH_CMA51H-S-DCXX-C
  round 2.3 hole 1.5: 1(-3.83,-5) 2(-3.83,5) 3(-6.37,0) 4(6.37,-5) 5(6.37,5)
SMA_L4.3-W2.6-LS5.1-RD
  rect 2x2 smd: 1(-2.2,0) 2(2.2,0)
SOD-123_L2.7-W1.6-LS3.7-BI
  rect 1x1.2 smd: 1(-1.675,0) 2(1.675,0)
SOD-123_L2.8-W1.8-LS3.7-RD
  rect 0.95x1.15 smd: 1(-1.692,0) 2(1.692,0)
SOIC-8_L4.9-W3.9-P1.27-LS6.0-BL
  oval 0.588x2.045 smd: 1(-1.905,-2.772) 2(-0.635,-2.772) 3(0.635,-2.772) 4(1.905,-2.772) 5(1.905,2.772) 6(0.635,2.772) 7(-0.635,2.772) 8(-1.905,2.772)
SOIC-8_L5.0-W4.0-P1.27-LS6.0-BL
  oval 0.569x1.95 smd: 1(-1.905,-2.705) 2(-0.635,-2.705) 3(0.635,-2.705) 4(1.905,-2.705) 5(1.905,2.705) 6(0.635,2.705) 7(-0.635,2.705) 8(-1.905,2.705)
SOIC-14_L8.7-W3.9-P1.27-LS6.0-BL
  oval 0.574x2.038 smd: 1(-3.81,-2.769) 2(-2.54,-2.769) 3(-1.27,-2.769) 4(0,-2.769) 5(1.27,-2.769) 6(2.54,-2.769) 7(3.81,-2.769) 8(3.81,2.769) 9(2.54,2.769) 10(1.27,2.769) 11(0,2.769) 12(-1.27,2.769) 13(-2.54,2.769) 14(-3.81,2.769)
SOT-23-3_L2.9-W1.3-P1.90-LS2.4-BR
  rect 1.25x0.7 smd: 1(1,-0.95) 2(1,0.95) 3(-1,0)
SOT-23-3_L2.9-W1.6-P1.90-LS2.8-BR
  rect 1.07x0.6 smd: 1(1.235,-0.95) 2(1.235,0.95) 3(-1.235,0)
SOT-23-5_L3.0-W1.7-P0.95-LS2.8-BR
  rect 1x0.6 smd: 1(1.3,-0.95) 2(1.3,0) 3(1.3,0.95) 4(-1.3,0.95) 5(-1.3,-0.95)
SOT-223-4_L6.5-W3.5-P2.30-LS7.0-BR
  rect 2.47x0.98 smd: 1(2.835,-2.3) 2(2.835,0) 3(2.835,2.3)
  rect 2.47x3.6 smd: 4(-2.835,0)

## Nets
As in the schematic.

Pads without a net: CN1 2 4; K1 4; U4 11 12 13; U5 1; U6 11 12 13; U8 1

## Via types
v1: diameter 0.61, hole 0.305, Top Layer to Bottom Layer, 171 vias

## Routing (per net, layer and track width the routed paths; a pad name or vN(x,y) marks a point on that pad's centre or on a via; arc(x,y) is an arc through that point)
5V: length 331.5
  Top Layer w0.254: v1(11.94,53.59) 7.74,53.59 C6.1 5.08,44.83 6.59,43.32 10.23,43.32 ; v1(46.35,54.48) 47.12,53.72 U11.8 ; 21.13,36.7 U10.11 ; 21.13,36.7 21.13,35.26 22.22,34.16 U10.9 ; 21.13,36.7 21.13,37.77 21.97,38.61 26.35,38.61 ; R31.1 31.84,26.59 35.76,26.59 36.52,25.83 36.52,23.65 39.78,23.65 39.83,23.7 ; 21.72,24.26 23.25,22.73 R20.2 ; 21.72,24.26 R27.1 20.64,27.36 v1(14.95,27.36) ; 21.72,24.26 13.21,24.26 10.05,21.11 ; R20.2 R2.2 R1.2 32.52,14.35 37.72,14.35 38.32,13.75 R16.2 ; R20.2 R26.2 ; 39.83,23.7 39.82,23.71 R32.2 40.46,26.92 v1(42.54,26.92) ; 39.83,23.7 R7.2 R14.2 ; U10.7 v1(15.37,32.89) 15.37,36.7 16.64,37.97 18.29,37.97 19.56,39.24 v1(19.56,46.61) 19.56,46.99 18.54,48.01 16.13,48.01 v1(15.49,48.64) ; 47.85,46.12 56.08,46.12 U8.5 58.86,45.27 v1(59.43,44.7) ; 47.85,46.12 U2.8 ; 47.85,46.12 47.85,49.85 U11.5 v1(44.7,49.91) ; U5.5 59.37,37.91 v1(59.44,37.97) 60.83,36.58 62.42,36.58 62.99,36.01 62.99,31.11 62.42,30.54 U9.5 ; 26.35,38.61 29.11,38.61 29.74,37.97 ; 26.35,38.61 26.35,44.02 ; U4.14 22.87,53.81 v1(21.13,53.81) ; 10.05,12.56 R29.2 ; 10.05,12.56 13.42,9.2 13.42,8.29 ; 10.05,12.56 10.05,21.11 ; 26.35,51.82 26.35,44.02 ; 26.35,51.82 21.14,51.82 v1(21.13,51.82) ; 26.35,51.82 27.62,53.09 34.65,53.09 U6.14 v1(37.51,53.72) ; 26.35,44.02 32.97,44.02 35.38,41.61 38.16,41.61 39.42,40.34 46.54,40.34 47.69,39.2 U3.8 47.67,36.72 45.65,36.72 ; 10.05,21.11 R28.2 ; U10.5 15.37,35.43 ; R13.2 v1(46.62,13.74)
  Bottom Layer w0.254: 44.71,54.53 46.3,54.53 v1(46.35,54.48) ; 44.71,54.53 38.33,54.53 v1(37.51,53.72) ; 44.71,54.53 44.7,54.53 v1(44.7,49.91) ; v1(14.95,27.36) 15.37,27.78 v1(15.37,32.89) ; v1(59.44,37.97) 59.44,44.7 ; v1(46.62,13.74) 45.96,14.39 45.96,26.61 45.71,26.86 45.57,26.86 ; v1(45.65,36.72) 45.67,36.7 45.67,26.96 45.57,26.86 ; v1(11.94,53.59) 14.73,53.59 15.49,52.83 v1(15.49,48.64) ; 45.57,26.86 45.51,26.92 v1(42.54,26.92) ; v1(21.13,53.81) v1(21.13,51.82) 21.96,51 21.96,47.78 20.78,46.61 v1(19.56,46.61)
12V: length 73.4
  Top Layer w0.254: v1(27.82,28.96) 15.37,28.96 13.45,27.03 F1.1 D1.2
  Bottom Layer w0.254: CN2.2 43.32,64.64 31.37,64.64 30.3,63.58 30.3,41.66 29.08,40.44 29.08,33.69 27.82,32.43 v1(27.82,28.96)
+12V: length 114.5
  Top Layer w0.254: v1(8.25,61.47) 6.14,61.47 5.43,60.76 ; 5.43,60.76 C1.1 ; 5.43,60.76 5.43,62.64 8.29,65.5 28.03,65.5 v1(28.19,65.66) ; v1(10.16,39.88) 10.16,38.79 U1.1 9.6,38.09 9.6,31.13 6.86,28.39 6.86,25.65 7.52,24.99 13.66,24.99 F1.2
  Bottom Layer w0.254: K1.2 57.64,60.98 51.94,66.67 29.21,66.67 v1(28.19,65.66) ; v1(8.25,61.47) 10.16,59.56 v1(10.16,39.88)
GND: length 318.9
  Top Layer w0.254: 48.12,24.4 53.06,24.4 54.24,25.58 55.11,25.58 ; 48.12,24.4 46.62,25.91 R22.1 ; 48.12,24.4 R17.1 R25.1 48.12,14.91 49.56,13.47 54.26,13.47 54.78,12.95 54.78,11.9 ; CN2.7 38.85,57.11 38.85,52.08 41.02,49.91 U11.4 42.38,44.58 50.75,44.58 51.95,43.37 U8.3 55.15,43.37 ; 11.96,60.71 12.57,60.09 12.57,52.07 11.43,50.93 C6.2 10.42,47.75 12.06,46.1 17.42,46.1 17.42,44.09 14.59,41.26 10.47,41.26 U1.2 U1.4 3.81,40.27 3.81,27.04 D1.1 3.05,24.77 3.05,20.49 6.66,16.88 R11.1 5.91,16.08 5.91,11.75 6.62,11.03 6.62,6.15 ; 22.96,37.97 23.6,37.34 34.65,37.34 35.28,37.97 36.58,37.97 41.02,33.53 42.28,33.53 ; 6.62,6.15 5.11,4.65 R24.1 ; 6.62,6.15 17.76,6.15 19.89,4.02 R8.1 21.72,4.47 21.58,4.6 21.45,4.6 21.45,5.88 21.58,5.88 21.72,6.01 21.72,6.01 21.86,6.15 23.22,6.15 ; 55.15,43.37 56.03,42.49 56.03,37.05 ; 55.15,43.37 55.84,44.07 61.57,44.07 Q3.2 ; 42.3,44.58 42.38,44.58 ; 42.3,44.58 U2.1 ; 42.3,44.58 31.27,44.58 29.74,46.1 ; R6.1 30.77,11.79 24.24,11.79 23.22,10.78 R19.1 23.22,6.15 ; 54.67,28.64 54.68,28.64 55.17,29.13 55.17,32.91 54.33,33.75 ; 54.67,28.64 55.11,28.21 55.11,25.58 ; 54.67,28.64 U9.3 ; 54.78,8.38 54.78,11.9 ; 54.78,8.38 C5.2 ; 54.78,8.38 54.78,4.32 54.65,4.19 C4.2 48.14,3.24 46.87,1.97 39.82,1.97 ; 55.11,25.58 56.99,23.7 C3.2 ; 56.03,37.05 54.99,36.01 U5.3 54.33,33.75 ; 56.03,37.05 58.87,37.05 60.33,35.6 Q5.2 ; 23.22,6.15 31.06,6.15 31.52,5.69 R18.1 31.52,2.51 32.07,1.97 39.82,1.97 ; 54.33,33.75 54.1,33.53 42.28,33.53 ; 42.28,33.53 U3.4 ; 39.82,1.97 R23.1 ; 54.78,11.9 Q6.2
AIR1: length 118.6
  Top Layer w0.254: U4.1 18.78,53.72 v1(18.78,53.71) ; R23.2 37.1,2.8 32.65,2.8 v1(32.64,2.79) ; v1(32.13,34.16) U7.6 v1(27.81,34.16) 27.18,34.79 23.6,34.79 U10.10
  Bottom Layer w0.254: v1(32.64,2.79) 29.08,2.79 26.94,4.94 26.94,33.29 v1(27.81,34.16) 19.81,34.16 18.29,35.69 18.29,53.22 v1(18.78,53.71) ; CN2.4 40.84,61.12 40.84,59.14 40.05,58.35 33.46,58.35 32.19,57.09 32.19,40.4 32.45,40.14 32.45,34.48 v1(32.13,34.16)
AIR2: length 201.5
  Top Layer w0.254: U7.10 37.34,35.43 38.05,34.72 38.05,31.92 38.72,31.25 v1(47.3,31.25) ; U10.8 21.63,31.56 v1(18.53,31.56) ; v1(45.96,61.13) 40.83,61.13 CN2.6 38.11,63.86 35.29,63.86 32.99,61.55 26.42,61.55 26.05,61.92 26.05,63.36 25.6,63.8 21,63.8 20.5,63.3 20.5,57.78 ; v1(20.45,57.78) 15.49,57.78 14.72,58.56 14.72,61.23 13.97,61.98 10.03,61.98 9.4,61.34 9.4,60.07 8.64,59.31 3.43,59.31 2.54,58.42 2.54,4.7 4.19,3.05 5.65,3.05 6.62,4.02 ; v1(19.96,53.41) 19,52.45 U4.2
  Bottom Layer w0.254: v1(20.45,57.78) 20.49,57.74 20.49,54.55 ; v1(47.3,31.25) 47.3,60.14 46.31,61.13 v1(45.96,61.13) ; v1(18.53,31.56) 17.85,32.25 17.85,54.04 18.34,54.53 20.47,54.53 20.49,54.55 ; 20.49,54.55 20.49,53.94 v1(19.96,53.41)
AIRYC: length 89.4
  Top Layer w0.254: U4.5 20.19,48.64 ; 20.19,48.64 20.19,52.57 20.7,53.08 25.52,53.08 26.35,53.91 26.35,60.39 27.03,61.07 34.79,61.07 CN2.8 ; 20.19,48.64 20.19,36.59 17.76,34.16 U10.6 18.06,33.53 31.12,33.53 31.75,32.89 U7.8 35.28,30.38 36.12,29.54 42.47,29.54 43.33,28.68 43.33,20.18 R25.2
B-V: length 126.8
  Top Layer w0.254: U3.5 46.93,32.14 v1(40.11,32.14) ; v1(31.34,36.7) U7.4 29.57,36.53 v1(26.28,36.53) ; v1(19.3,36.7) 17.43,36.7 ; R21.2 5.11,10.1 v1(5.02,10.19)
  Bottom Layer w0.254: v1(26.28,36.53) 25.7,35.94 20.07,35.94 v1(19.3,36.7) 22.42,39.82 22.42,58.9 CN1.3 12.34,59.59 11.29,58.53 11.29,30.97 5.02,24.71 v1(5.02,10.19) ; v1(31.34,36.7) 31.34,30.5 32,29.84 33.88,29.84 36.17,32.14 v1(40.11,32.14)
GREEN/TSOFF: length 77.2
  Top Layer w0.254: CN2.5 CN2.3 42.34,59.13 44.9,56.57 44.9,53.53 45.34,53.09 48.93,53.09 50.55,51.48 50.55,48.51 51.18,47.88 62.27,47.88 63.79,46.36 63.79,40 66.17,37.63 66.17,6.22 64.9,4.95 Q2.3
MC-V: length 125.8
  Top Layer w0.254: v1(29.19,41.67) 31.69,41.67 33.48,39.88 35.99,39.88 36,39.87 36.51,39.87 36.77,39.6 38.38,39.6 40.11,37.87 40.11,36.07 42.02,34.16 U3.3 ; v1(49.71,51.18) 42.38,51.18 ; v1(51.03,25.47) 48.94,25.47 R22.2
  Bottom Layer w0.254: 29.16,51.66 29.11,51.7 25.51,51.7 24.74,52.48 CN1.1 ; 29.16,51.66 29.19,51.62 29.19,43.89 28.86,43.56 28.86,42 v1(29.19,41.67) ; 29.16,51.66 29.16,65.25 30.07,66.17 47.86,66.17 49.71,64.32 v1(49.71,51.18) 52.46,48.43 52.46,26.91 v1(51.03,25.47)
RED: length 48
  Top Layer w0.254: v1(45.72,53.72) 45.72,56.64 45.34,57.02 45.34,59.62 CN2.1 ; v1(45.72,50.55) 48.9,50.55 49.91,49.53 49.91,48.26 50.86,47.31 61.75,47.31 63.38,45.68 63.38,39.28 65.55,37.11 65.55,29.58 64.61,28.65
  Bottom Layer w0.254: v1(45.72,50.55) v1(45.72,53.72)
$1N2847: length 17
  Top Layer w0.254: v1(53.17,12.84) 48.27,12.84 R13.1 ; v1(60.01,17.51) 62.14,19.64 Q4.2
  Bottom Layer w0.254: v1(60.01,17.51) 55.34,12.84 v1(53.17,12.84)
$1N2848: length 73.2
  Top Layer w0.254: v1(17.01,4.02) 17.01,4.02 R12.1 ; v1(53.47,9.91) 48.27,9.91 C5.1 46.74,10.42 45.37,11.79 35.93,11.79 33.94,13.78 23.18,13.78 22.49,13.09 22.49,11.2 v1(21.72,10.43) R19.2 ; v1(63.83,14.25) 62.68,14.25 Q6.1 ; Q4.3 64.1,20.24 v1(64.1,20.1)
  Bottom Layer w0.254: 63.83,14.02 59.72,9.91 v1(53.47,9.91) ; 63.83,14.02 v1(63.83,14.25) ; 63.83,14.02 64.1,14.3 v1(64.1,20.1) ; v1(17.01,4.02) 17.01,7.74 19.7,10.43 v1(21.72,10.43)
$1N2855: length 70.2
  Top Layer w0.254: v1(54.82,20.36) 56.16,21.69 Q4.1 64.92,21.69 65.53,21.08 65.53,14.15 Q6.3 ; R14.1 38.32,15.63 v1(38.34,15.61) ; v1(54.36,44.32) U8.2
  Bottom Layer w0.254: v1(54.36,44.32) 54.76,43.92 54.76,20.42 v1(54.82,20.36) 54.82,16.35 53.45,14.99 50.16,14.99 49.66,14.48 49.66,13.59 48.85,12.78 39.69,12.78 39.57,12.91 39.57,13.03 39.58,13.04 39.58,14.3 38.34,15.54 v1(38.34,15.61)
$1N2859: length 9.7
  Top Layer w0.254: Q5.1 60.75,38.88 57.89,38.88 56.93,39.85 U8.4
$1N2861: length 113.5
  Top Layer w0.254: v1(10.92,66.17) 11.68,66.93 47.98,66.93 K1.1 ; D3.2 7.39,33.02 v1(7.4,33.02) ; Q5.3 62.99,38.16 62.99,44.68 60.32,44.68 58.9,46.1 v1(58.17,46.1)
  Bottom Layer w0.254: K1.1 58.17,56.74 v1(58.17,46.1) ; v1(7.4,33.02) 7.4,62.64 v1(10.92,66.17)
$1N2891: length 1.3
  Top Layer w0.254: 29.74,51.18 U6.4
$1N2893: length 74.2
  Top Layer w0.254: v1(36.64,40.5) 35.29,40.5 U7.14 ; v1(28.83,14.73) 28.8,14.7 15.46,14.7 14.2,13.44 14.2,9.01 R30.1 ; U6.5 30.38,48.01 37.21,48.01 v1(37.72,47.5)
  Bottom Layer w0.254: v1(37.72,47.5) 36.93,46.71 36.93,40.5 ; 28.83,14.74 v1(28.83,14.73) 32.89,14.73 33.91,15.75 33.91,19.82 36.32,22.23 36.32,25.65 41.47,30.8 41.47,32.7 40.7,33.46 39.2,33.46 36.93,35.73 36.93,40.5 ; 36.93,40.5 v1(36.64,40.5)
$1N2896: length 5.5
  Top Layer w0.254: U6.6 U6.9
$1N2911: length 74.5
  Top Layer w0.254: v1(29,4.02) 27,4.02 26.03,3.05 14.39,3.05 13.42,4.02 ; 35.28,46.1 35.93,45.46 v1(40.1,45.46)
  Bottom Layer w0.254: v1(29,4.02) 29.46,3.55 33.3,3.55 35.43,5.68 35.43,15.22 37.79,17.58 37.79,26.34 39.06,27.61 41.67,27.61 42.8,28.74 42.8,33.4 40.1,36.1 v1(40.1,45.46)
$1N2915: length 75.3
  Top Layer w0.254: v1(24.88,8.29) R9.1 31.07,7.24 51.56,7.24 52.83,5.97 v1(54.1,5.97) ; v1(59.82,5.97) 61.78,5.97 Q2.1 ; R11.2 v1(5.67,16.83)
  Bottom Layer w0.254: v1(59.82,5.97) v1(54.1,5.97) ; v1(24.88,8.29) 24.88,4.7 22.48,2.29 13.33,2.29 11.56,4.06 11.56,16 10.72,16.83 v1(5.67,16.83)
$1N2916: length 72.9
  Top Layer w0.254: v1(56.39,5.21) 57.4,6.22 57.4,8.76 59.44,10.79 62.74,10.79 63.25,11.3 63.25,12.45 62.74,12.95 56.43,12.95 LED6.2 ; R10.1 13.45,13.57 15.87,16 v1(27.82,16) ; v1(29.34,6.86) 31.46,6.86 32.4,5.92 48.56,5.92 49.28,5.21 v1(51.69,5.21)
  Bottom Layer w0.254: v1(29.34,6.86) 27.82,8.37 v1(27.82,16) ; v1(51.69,5.21) v1(56.39,5.21)
$1N2920: length 106.7
  Top Layer w0.254: v1(37.21,8.25) 31.56,8.25 R9.2 29.78,10.03 v1(24.89,10.03) ; v1(48.77,2.16) 62.87,2.16 66.8,6.1 66.8,37.85 66.04,38.61 66.04,45.08 63.93,47.2 K1.5
  Bottom Layer w0.254: v1(37.21,8.25) 37.21,2.92 37.97,2.16 v1(48.77,2.16) ; v1(14.99,12.56) 22.36,12.56 v1(24.89,10.03)
$1N2921: length 102.3
  Top Layer w0.254: v1(55.39,39.57) 52.22,39.57 51.24,40.55 51.24,43.12 50.42,43.94 U2.7 ; v1(24.89,21.84) 25.84,22.79 31.57,22.79 32.51,21.84 32.51,20.7 34.42,18.8 38.61,18.8 39.08,18.33 39.08,16.29 40.18,15.19 46.15,15.19 47.37,13.97 47.37,11.86 v1(52.92,11.86) ; v1(21.97,18.92) 21.74,18.69 21.74,16.83 R3.2 ; v1(55.9,18.35) 57,18.35 D2.2
  Bottom Layer w0.254: 55.97,18.35 v1(55.9,18.35) ; 55.97,18.35 55.97,38.99 v1(55.39,39.57) ; 55.97,18.35 60.77,18.35 61.64,17.48 61.64,13.76 59.74,11.86 v1(52.92,11.86) ; v1(21.97,18.92) v1(24.89,21.84)
$1N2924: length 41.3
  Top Layer w0.254: v1(50.42,16.51) 50.44,16.48 v1(50.44,14.25) ; v1(50.16,41.4) U2.5 ; v1(46.74,4.94) C4.1
  Bottom Layer w0.254: v1(50.42,16.51) 50.16,16.76 50.16,41.55 ; v1(50.44,14.25) 50.44,10.69 46.74,6.99 v1(46.74,4.94)
$1N2925: length 73.6
  Top Layer w0.254: R5.2 39.82,8.39 37.29,10.92 v1(34.8,10.92) ; v1(41.91,28.96) 37.85,28.96 37.16,28.27 v1(37.16,24.28) ; 21.74,12.56 20.13,10.96 v1(20.13,9.69) ; v1(30.86,5.33) 22.18,5.33 v1(22.08,5.24) ; v1(39.22,42.28) 41.91,42.28 U2.3
  Bottom Layer w0.254: v1(41.91,28.96) 42.16,29.21 42.16,33.02 41.24,33.95 39.8,33.95 38.65,35.09 38.65,41.72 v1(39.22,42.28) ; v1(30.86,5.33) 30.86,7 34.8,10.93 ; v1(37.16,24.28) 37.16,21.71 34.8,19.36 34.8,10.93 ; v1(34.8,10.92) 34.8,10.93 ; v1(22.08,5.24) 20.13,7.19 v1(20.13,9.69)
$1N2926: length 39.3
  Top Layer w0.254: R5.1 38.26,8.29 v1(38.23,8.25) ; v1(62.61,9.4) 62.74,9.27 62.74,5.46 62.23,4.95 57.06,4.95 LED7.2
  Bottom Layer w0.254: v1(62.61,9.4) 54.81,9.4 53.48,8.07 53.48,8.03 49.38,3.93 42.56,3.93 v1(38.23,8.25)
$1N2929: length 73.4
  Top Layer w0.254: v1(63.1,25.75) 61.44,25.75 61.09,26.1 61.09,29.24 61.44,29.59 Q1.1 ; 30.03,12.79 R6.2 ; 30.03,12.79 30.03,12.79 v1(29,12.79) ; 30.03,12.79 23.47,12.79 R4.2 ; v1(49.91,6.6) v1(34.67,6.6)
  Bottom Layer w0.254: v1(34.67,6.6) 32.37,4.31 30.62,4.31 29.97,4.95 29.97,11.82 v1(29,12.79) ; v1(49.91,6.6) 49.91,9.27 51.18,10.54 59.31,10.54 63.1,14.33 v1(63.1,25.75)
$1N2932: length 188.9
  Top Layer w0.254: v1(47.5,65.53) 46.61,66.42 12.45,66.42 v1(12.19,66.17) ; R3.1 12.56,16.83 10.84,15.11 v1(10.8,15.11) ; U2.2 43.03,43.94 44.3,42.67 U2.6 v1(49.53,42.67) ; 54.12,21.77 54.12,18.22 D2.1 ; 54.12,21.77 49.58,21.77 v1(49.53,21.72) ; 54.12,21.77 54.12,23.02 C3.1
  Bottom Layer w0.254: v1(47.5,65.53) 48.81,64.22 48.81,50.51 51.56,47.76 51.56,44.7 v1(49.53,42.67) v1(49.53,21.72) ; v1(10.8,15.11) 9.83,14.14 9.83,2.59 9.19,1.96 5.79,1.96 4.35,3.4 4.35,24.91 10.83,31.38 10.83,63.36 12.19,64.73 v1(12.19,66.17)
$1N2938: length 46.4
  Top Layer w0.254: Q3.3 65.41,43.65 v1(65.41,41.66) ; v1(64.89,26.79) 63.99,27.69 62.14,27.69 ; 61.85,4 v1(62.67,4)
  Bottom Layer w0.254: v1(62.67,4) 65.4,6.73 65.4,26.79 ; v1(65.41,41.66) 65.4,41.65 65.4,26.79 ; 65.4,26.79 v1(64.89,26.79)
$1N2947: length 74.7
  Top Layer w0.254: v1(50.42,46.74) 60.8,46.74 Q3.1 ; v1(22.59,22.56) 16.41,22.56 R15.1 ; 46.62,21.35 R17.2 ; 46.62,21.35 v1(44.22,21.35) ; 46.62,21.35 v1(46.62,21.85) ; v1(39.12,20.16) 33.94,20.16 33.15,20.95 33.15,22.35 32,23.49 v1(24.13,23.49)
  Bottom Layer w0.254: v1(39.12,20.16) 43.03,20.16 v1(44.22,21.35) ; v1(46.62,21.85) 46.62,27.57 48.89,29.84 48.89,45.21 v1(50.42,46.74) ; v1(24.13,23.49) 23.19,22.56 v1(22.59,22.56)
$1N2957: length 1.3
  Top Layer w0.254: 17.42,51.18 U4.4
$1N2959: length 18
  Top Layer w0.254: U4.6 15.24,47.37 14.73,47.88 14.73,51.05 15.49,51.82 19.4,51.82 v1(19.49,51.9) ; v1(20.96,48.01) 21.59,47.37 U4.9
  Bottom Layer w0.254: v1(20.96,48.01) 19.49,49.47 v1(19.49,51.9)
$1N2978: length 36.2
  Top Layer w0.254: 22.97,46.11 24.45,44.63 25.14,44.63 ; 54.32,36.96 53.69,36.96 52.8,36.08 45.2,36.08 44.83,36.45 44.83,37.08 43.93,37.98 41,37.98 37.79,41.19 34.51,41.19 32.41,43.3 v1(27.31,43.3)
  Bottom Layer w0.254: v1(25.14,44.63) 26.47,43.3 v1(27.31,43.3)
$1N2980: length 41.2
  Top Layer w0.254: v1(58.42,35.94) 56.99,35.94 U5.4
  Bottom Layer w0.254: v1(58.42,35.94) 63.63,35.94 64.52,36.83 64.52,41.83 65.88,43.19 65.88,61.52 63.62,63.79 59.2,63.79 K1.3
$1N2999: length 193.4
  Top Layer w0.254: v1(17.41,58.93) 17.41,63.89 18.07,64.55 v1(29.8,64.55) ; R7.1 36.17,21.11 35.09,22.19 v1(35.09,25.12) ; 42.28,35.42 43.4,35.42 44.65,34.16 U3.6 ; 42.28,35.42 v1(42.29,35.43) ; 42.28,35.42 U3.2 ; v1(29.62,42.53) 29,42.53 28.44,41.97 28.44,40.14 28.7,39.88 29.18,39.88 29.19,39.88 30.73,39.88 31.18,39.43 31.18,39.05 31.62,38.61 37.75,38.61 v1(37.93,38.79) ; R8.2 23.24,4.04 v1(23.24,4.06)
  Bottom Layer w0.254: v1(35.09,25.12) 35.09,30.14 35.8,30.85 40.37,30.85 40.88,31.35 40.88,32.4 40.3,32.98 38.3,32.98 35.71,35.56 35.71,46.5 37.34,48.12 39.4,48.12 ; v1(42.29,35.43) 42.29,46.35 40.53,48.12 39.4,48.12 ; v1(29.8,64.55) 29.8,42.72 v1(29.62,42.53) ; v1(17.41,58.93) 16.32,57.84 16.32,48.43 12.31,44.42 12.31,4.33 13.84,2.79 21.97,2.79 v1(23.24,4.06) ; 39.4,48.12 37.93,46.64 v1(37.93,38.79)
$1N3023: length 31.3
  Top Layer w0.254: LED5.2 57.53,9.75 v1(57.53,11.18) ; R1.1 33.39,14.99 39.2,14.99 42.04,12.15 45.52,12.15 46.49,11.18 v1(51.56,11.18)
  Bottom Layer w0.254: v1(57.53,11.18) v1(51.56,11.18)
$1N3072: length 63.7
  Top Layer w0.254: U9.2 v1(46.48,29.59) 45.2,28.31 v1(45.2,25.94) ; R26.1 31.54,20.79 34.27,18.06 v1(38.4,18.06) ; U11.7 45.09,52.45 43.81,53.72 U11.1
  Bottom Layer w0.254: v1(38.4,18.06) 38.4,25.7 38.64,25.94 v1(45.2,25.94) ; v1(46.45,52.45) 46.45,29.62 v1(46.48,29.59)
$1N3096: length 113.6
  Top Layer w0.254: v1(25.65,55.37) 25.64,55.35 v1(19.57,55.35) ; U9.4 56.96,28.68 v1(56.96,29.59) ; R15.2 13.46,21.09 v1(13.46,21.08) ; v1(26.77,62.21) 31.64,62.21 33.77,64.34 49.45,64.34 52.2,61.59 52.2,59.12 v1(52.97,58.35)
  Bottom Layer w0.254: v1(13.46,21.08) 16.91,24.53 16.91,54.38 17.89,55.35 v1(19.57,55.35) ; v1(26.77,62.21) 26.77,56.48 v1(25.65,55.37) ; v1(52.97,58.35) 56.96,54.35 v1(56.96,29.59)
$1N3104: length 105.6
  Top Layer w0.254: U7.9 34.28,34.16 33.01,35.43 ; U7.11 34.28,36.7 33.01,35.43 ; v1(26.27,30.55) 26.33,30.49 29.74,30.49 ; 33.01,35.43 v1(29.74,35.43) ; v1(40.19,52) 40.64,52.45 U11.2 ; 29.74,30.49 v1(29.74,32.89) ; 29.74,30.49 29.75,30.48 v1(33.15,30.48) ; R18.2 30.02,1.61 v1(30.1,1.52) ; v1(38.99,13.46) 39.83,12.62 R16.1
  Bottom Layer w0.254: v1(26.27,30.55) 26.27,2.56 27.31,1.52 v1(30.1,1.52) 35.31,1.52 36.51,2.72 36.51,10.98 v1(38.99,13.46) ; v1(33.15,30.48) 33.15,50.8 34.35,52 v1(40.19,52) ; v1(29.74,35.43) v1(29.74,32.89)
$1N11259: length 79.5
  Top Layer w0.254: U9.1 45.41,30.54 45.09,30.86 38.61,30.86 37.7,31.77 37.7,33.04 37.21,33.53 33.78,33.53 32.51,34.8 27.94,34.8 27.18,35.56 25.78,35.56 v1(24.76,36.58) ; v1(18.92,41.91) 17.53,40.51 U10.1 U10.2 v1(15.62,39.24) ; 21.74,21.11 20.82,20.19 12.45,20.19 11.94,20.7 11.94,22.22 12.7,22.99 v1(13.59,22.99) ; v1(21.46,41.91) 22.86,40.51 U10.14 ; 22.96,40.51 22.96,39.24
  Bottom Layer w0.254: v1(22.96,39.24) 23.88,39.24 24.76,38.35 v1(24.76,36.58) ; v1(21.46,41.91) v1(18.92,41.91) ; v1(15.62,39.24) 14.35,39.24 13.59,38.48 v1(13.59,22.99)
$1N21896: length 92.9
  Top Layer w0.254: v1(31.81,39.51) 32.08,39.24 U7.13 ; v1(27.31,49.28) 28.87,49.28 28.88,49.28 32.51,49.28 ; 32.51,49.28 31.57,50.23 v1(31.41,50.23) ; 32.51,49.28 34.64,49.28 U6.10 ; v1(23.58,54.62) 16.01,54.62 14.22,52.83 14.22,47.62 15.11,46.74 18.81,46.74 18.81,44.21 14.73,40.13 14.73,30.73 15.71,29.75 27.95,29.75 28.57,29.13 28.57,26.92 27.95,26.29 R27.2
  Bottom Layer w0.254: v1(31.81,39.51) 31.41,39.91 v1(31.41,50.23) ; v1(27.31,49.28) 24.64,49.28 23.58,50.33 v1(23.58,54.62)
$1N21955: length 203.8
  Top Layer w0.254: v1(30.7,40.91) 30.3,40.51 U7.1 ; v1(46.74,2.92) 46.35,2.92 44.15,5.12 36.36,5.12 v1(34.8,3.56) ; v1(8.76,2.54) 27.94,2.54 v1(28.32,2.16) ; v1(33.02,52.45) U6.2 ; v1(6.01,9.39) 6.01,10.65 5.15,11.51 R29.1 ; v1(66.68,42.8) 66.68,50.8 63.31,54.16 52.71,54.16 50.48,56.39 v1(46.48,56.39)
  Bottom Layer w0.254: 43.84,57.91 43.81,57.88 33.88,57.88 33.02,57.02 v1(33.02,52.45) ; 43.84,57.91 43.84,63.1 42.94,64.01 38.75,64.01 37.84,63.1 37.84,62.14 36.83,61.12 31.4,61.12 30.77,60.49 30.77,40.98 v1(30.7,40.91) ; 43.84,57.91 45.37,56.39 v1(46.48,56.39) ; v1(8.76,2.54) 8.76,6.64 v1(6.01,9.39) ; v1(46.74,2.92) 63.25,2.92 66.68,6.35 v1(66.68,42.8) ; v1(34.8,3.56) 33.4,2.16 v1(28.32,2.16)
$1N22037: length 116.9
  Top Layer w0.254: v1(28.32,50.42) 28.32,51.43 28.69,51.81 37.58,51.81 38.27,52.5 38.27,56.72 37.88,57.12 29.74,57.12 ; v1(28.32,39.24) U7.2 ; 29.74,57.12 U6.1 ; 29.74,57.12 28.57,58.29 v1(28.57,59.69) ; v1(3.68,21.11) R28.1
  Bottom Layer w0.254: v1(28.32,50.42) 28.35,50.39 28.35,39.27 v1(28.32,39.24) ; v1(28.57,59.69) 28.57,62.25 24.03,66.8 8.89,66.8 3.68,61.59 v1(3.68,21.11)
$1N22090: length 31.7
  Top Layer w0.254: R31.2 32.57,28.83 v1(35.81,28.83) ; v1(44.82,41.65) 42.55,41.65 U2.4 ; v1(37.21,30.23) v1(43.94,30.23) ; v1(43.96,36.89) 42.46,36.89 U3.1
  Bottom Layer w0.254: v1(43.94,30.23) 43.96,30.25 v1(43.96,36.89) 43.96,40.78 v1(44.82,41.65) ; v1(37.21,30.23) v1(35.81,28.83)
$1N22133: length 55.7
  Top Layer w0.254: 45.45,35.3 45.44,35.29 v1(44.88,35.29) ; 45.45,35.3 47.55,35.3 U3.7 ; 45.45,35.3 44.58,35.3 43.8,36.08 40.77,36.08 v1(40.77,36.7) ; v1(39.12,25.27) 38.32,26.07 R32.1 ; v1(44.45,23.9) 44.38,23.97 v1(44.38,27.78) ; U4.10 23.9,48.64 v1(25.1,47.44) ; v1(40.77,45.97) 40,46.74 v1(27.31,46.74)
  Bottom Layer w0.254: v1(27.31,46.74) 25.8,46.74 v1(25.1,47.44) ; 40.77,45.98 40.77,46.15 ; 40.77,45.98 v1(40.77,45.97) ; 40.77,45.98 v1(40.77,36.7) ; v1(44.38,27.78) 44.85,28.26 44.85,35.26 v1(44.88,35.29) ; v1(44.45,23.9) 43.07,25.27 v1(39.12,25.27)

## Copper pours and planes (outline as drawn; the poured copper is in the pictures)
5V on Bottom Layer: -2.54,70.48 70.36,70.48 70.36,-1.78 -2.54,-1.78
GND on Top Layer: -0.76,68.96 69.09,68.96 69.09,-0.64 -0.76,-0.64

Small or netless copper shapes (teardrops, artwork), in the pictures only: 451 on Top Layer, 198 on Bottom Layer

## Text on the board
Top Silkscreen Layer: GREEN\TSOFF | GND | YC | 2 | 1 | 12V | POWER | GREEN | RED | 5V | BV | MCV
